# EAGLE design VCFAA_v2 (EAGLE 9.4.2)

## Sheet 1 of 3: Power Supply
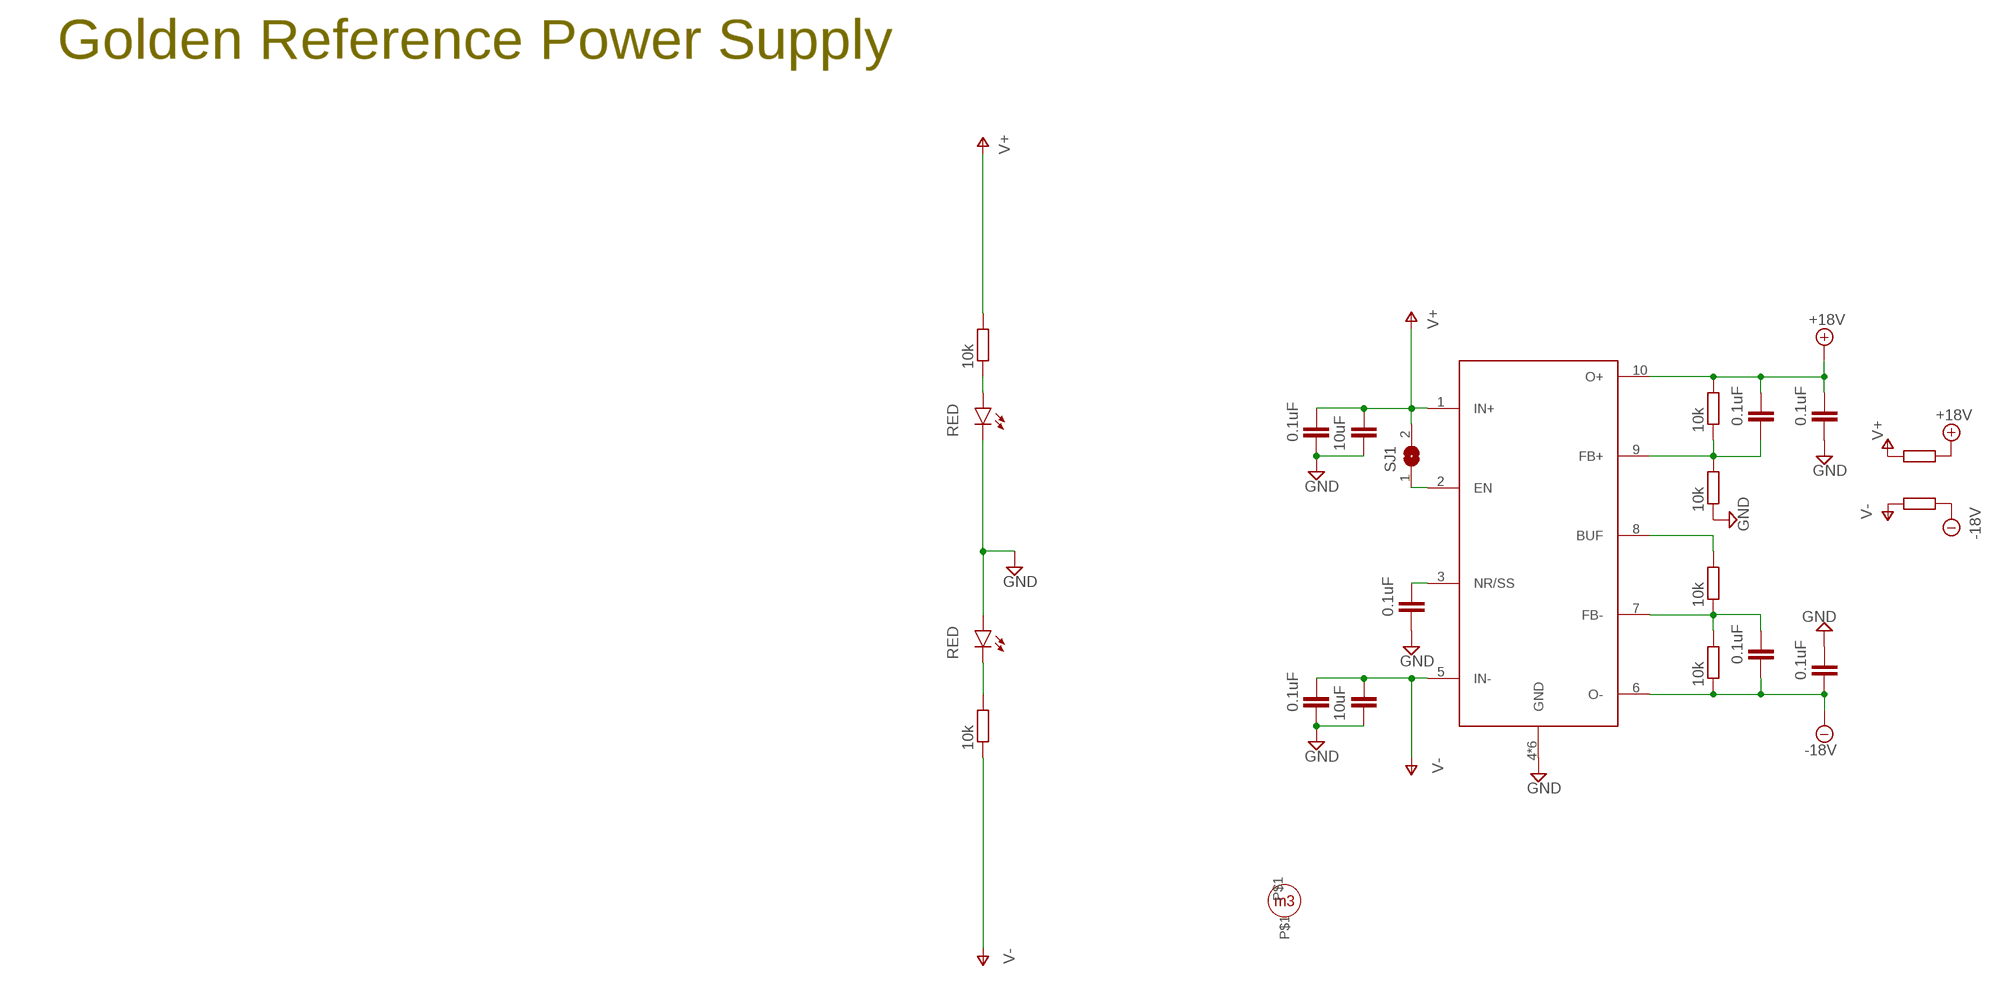
[diagram p0: schematic, sheet 1]

### Parts
C2  0.1uF  C-EUC0805  [C0805]
C65  10uF  C-EUC1206  [C1206]
C66  10uF  C-EUC1206  [C1206]
C67  0.1uF  C-EUC0805  [C0805]
C68  0.1uF  C-EUC0805  [C0805]
C69  0.1uF  C-EUC0805  [C0805]
C70  0.1uF  C-EUC0805  [C0805]
C71  0.1uF  C-EUC0805  [C0805]
C72  0.1uF  C-EUC0805  [C0805]
H8  HOLE  [M3_HOLE]
LED17  RED  LEDVWV1206  [LED_SML1206]
LED18  RED  LEDVWV1206  [LED_SML1206]
R131  10k  R-EU_MELF0204W  [MINI_MELF-0204W]
R132  10k  R-EU_MELF0204W  [MINI_MELF-0204W]
R136  10k  R-EU_MELF0204W  [MINI_MELF-0204W]
R137  10k  R-EU_MELF0204W  [MINI_MELF-0204W]
R138  10k  R-EU_MELF0204W  [MINI_MELF-0204W]
R139  10k  R-EU_MELF0204W  [MINI_MELF-0204W]
R140  10k  R-EU_MELF0204W  [MINI_MELF-0204W]
R141  10k  R-EU_MELF0204W  [MINI_MELF-0204W]
SJ1  SJ  [SJ]
U$5  TPS7A39WSON10-7A39  [SON50P300X300X80-11T165X240N]

### Nets
+18V: C69.1 C71.1 R136.2 R141.1 U$5.10(O+) ; also sheet 2,3
-18V: C70.2 C72.2 R139.1 R140.1 U$5.6(O-) ; also sheet 2,3
GND: C2.2 C65.2 C66.2 C67.2 C68.2 C69.2 C70.1 LED17.C LED18.A R137.1 U$5.4(GND) U$5.11(GND) U$5.12(GND) U$5.13(GND) U$5.14(GND) U$5.15(GND) ; also sheet 2,3
N$24: SJ1.1 U$5.2(EN)
N$138: LED18.C R132.2
N$139: LED17.A R131.1
N$142: C72.1 R138.1 R139.2 U$5.7(FB-)
N$145: R138.2 U$5.8(BUF)
N$146: C71.2 R136.1 R137.2 U$5.9(FB+)
N$148: C2.1 U$5.3(NR/SS)
V+: C66.1 C68.1 R131.2 R141.2 SJ1.2 U$5.1(IN+) ; also sheet 2,3
V-: C65.1 C67.1 R132.1 R140.2 U$5.5(IN-) ; also sheet 2,3
Unconnected: H8.P$1

### Notes on the sheet
- Golden Reference Power Supply

## Sheet 2 of 3: Balance Input Block
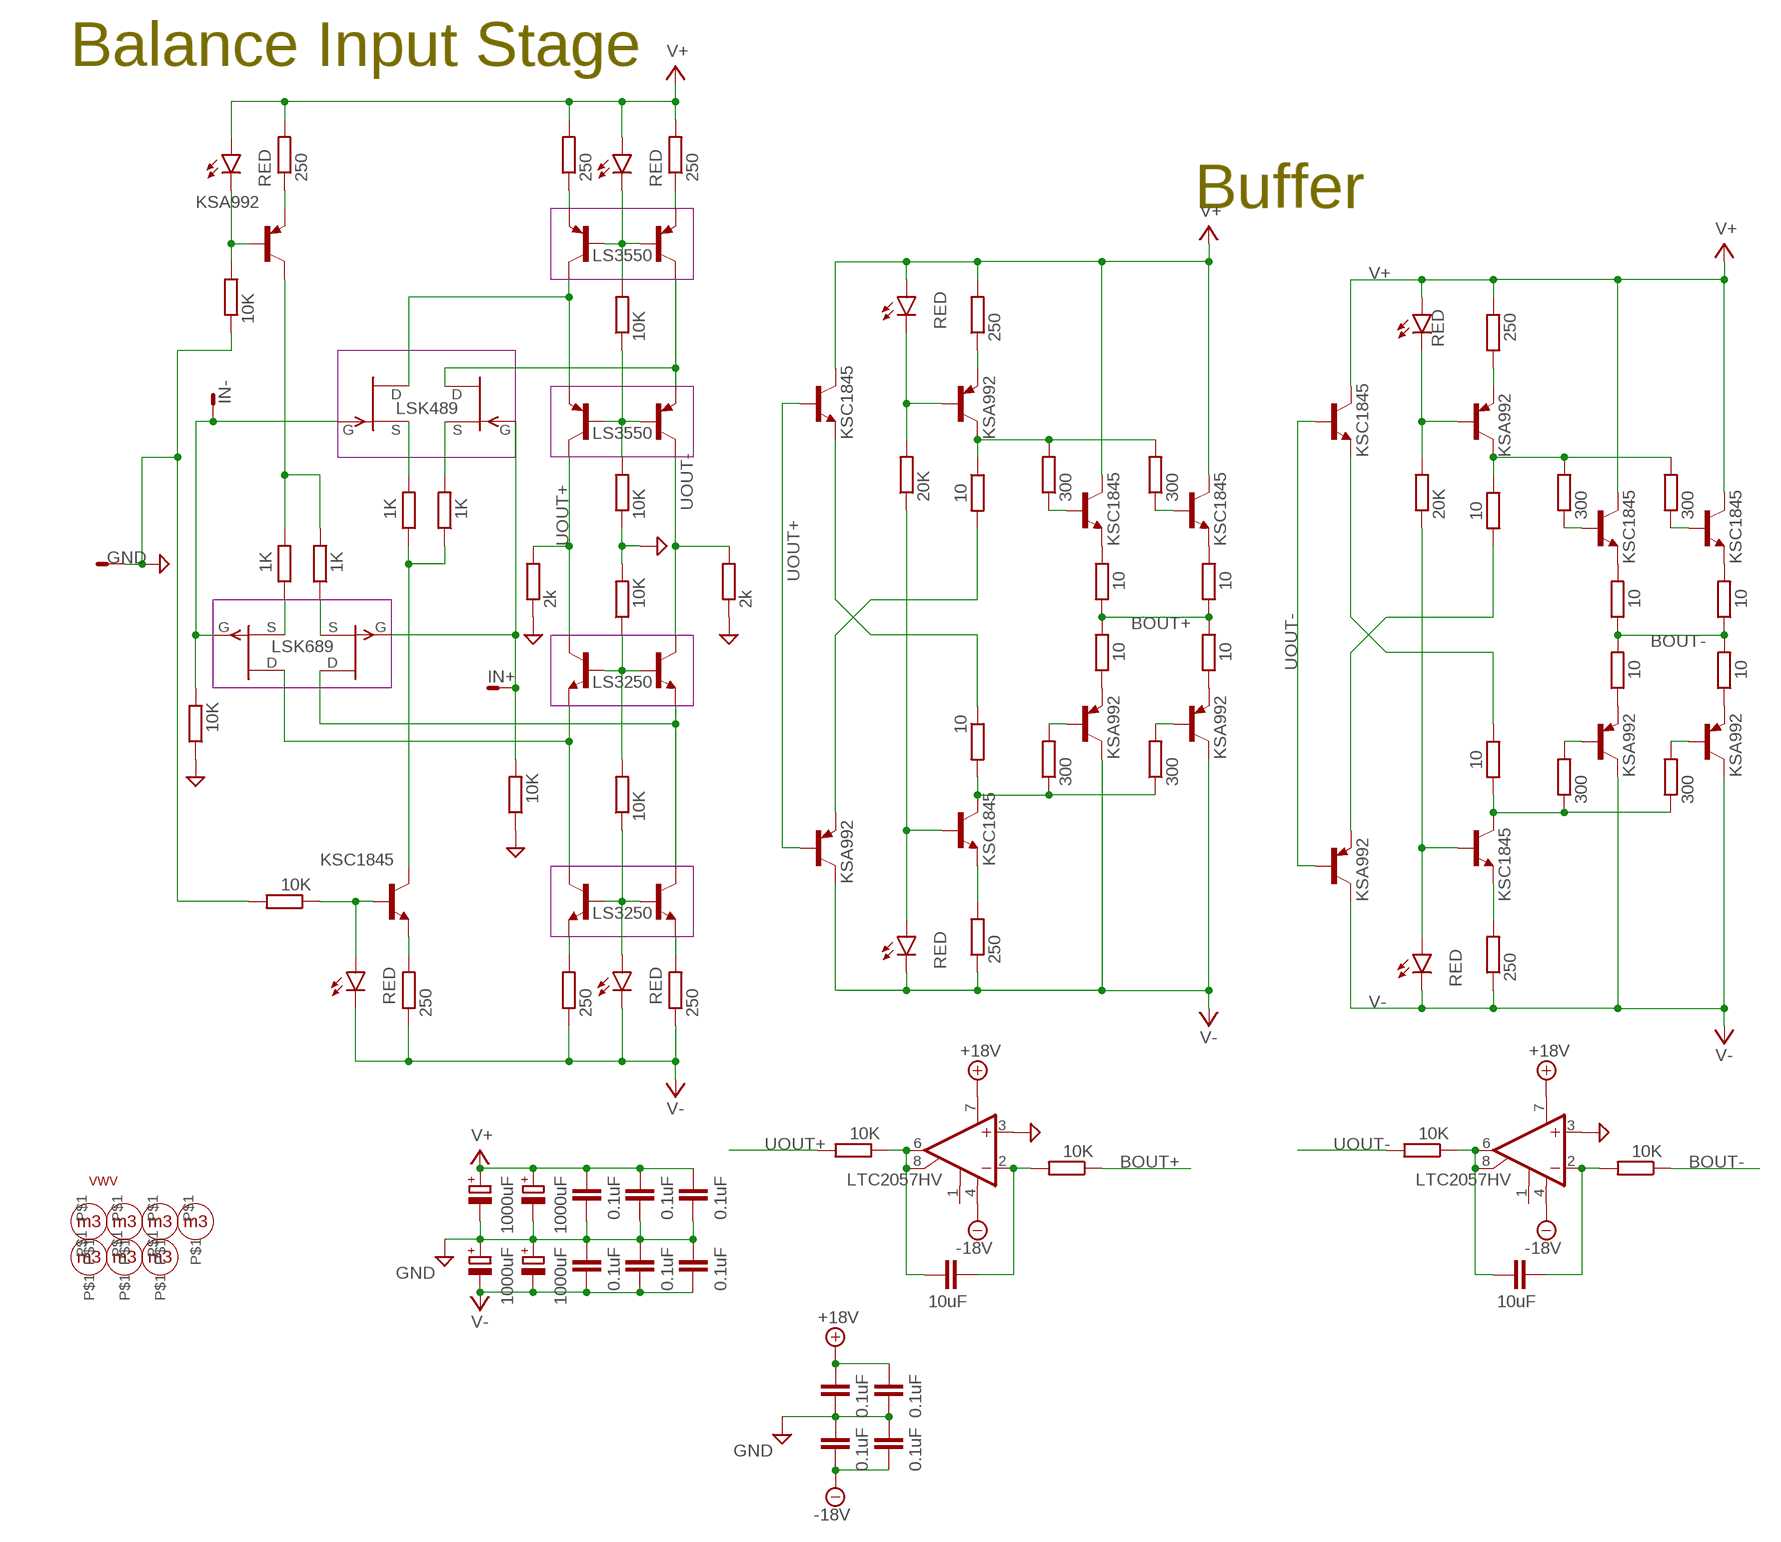
[diagram p1: schematic, sheet 2]

### Parts
C3  0.1uF  C-EUC0805  [C0805]
C4  0.1uF  C-EUC0805  [C0805]
C5  1000uF  CPOL-EUE7.5-18  [E7,5-18]
C6  1000uF  CPOL-EUE7.5-18  [E7,5-18]
C7  1000uF  CPOL-EUE7.5-18  [E7,5-18]
C8  1000uF  CPOL-EUE7.5-18  [E7,5-18]
C9  0.1uF  C-EU050-045X075  [C050-045X075]
C10  0.1uF  C-EU050-045X075  [C050-045X075]
C11  0.1uF  C-EU050-045X075  [C050-045X075]
C12  0.1uF  C-EU050-045X075  [C050-045X075]
C13  10uF  C-EUC1206  [C1206]
C14  0.1uF  C-EUC0805  [C0805]
C15  0.1uF  C-EUC0805  [C0805]
C16  10uF  C-EUC1206  [C1206]
C74  0.1uF  C-EU050-045X075  [C050-045X075]
C75  0.1uF  C-EU050-045X075  [C050-045X075]
H1  HOLE  [M3_HOLE]
H2  HOLE  [M3_HOLE]
H3  HOLE  [M3_HOLE]
H4  HOLE  [M3_HOLE]
H5  HOLE  [M3_HOLE]
H6  HOLE  [M3_HOLE]
H7  HOLE  [M3_HOLE]
IC1  LTC2057HV  LT1007CS8  [SOIC8]
IC2  LTC2057HV  LT1007CS8  [SOIC8]
LED1  RED  LEDVWV1206  [LED_SML1206]
LED2  RED  LEDVWV1206  [LED_SML1206]
LED3  RED  LEDVWV1206  [LED_SML1206]
LED4  RED  LEDVWV1206  [LED_SML1206]
LED5  RED  LEDVWV1206  [LED_SML1206]
LED6  RED  LEDVWV1206  [LED_SML1206]
LED7  RED  LEDVWV1206  [LED_SML1206]
LED8  RED  LEDVWV1206  [LED_SML1206]
Q1  LSK689  [SOT-23-6]
Q2  KSA992  BJT_PNPKSA992  [TRANSISTOR_TO92-ECB_P]
Q3  KSC1845  BJT_NPNKSC1845  [TRANSISTOR_TO92-ECB_N]
Q4  LSK489  LSK489SOP-6  [SOT-23-6]
Q5  LS3550  [SOT-23-6]
Q6  LS3250  [SOT-23-6]
Q7  LS3250  [SOT-23-6]
Q8  LS3550  [SOT-23-6]
Q9  KSC1845  BJT_NPNKSC1845  [TRANSISTOR_TO92-ECB_N]
Q10  KSA992  BJT_PNPKSA992  [TRANSISTOR_TO92-ECB_P]
Q11  KSA992  BJT_PNPKSA992  [TRANSISTOR_TO92-ECB_P]
Q12  KSC1845  BJT_NPNKSC1845  [TRANSISTOR_TO92-ECB_N]
Q13  KSC1845  BJT_NPNKSC1845  [TRANSISTOR_TO92-ECB_N]
Q14  KSA992  BJT_PNPKSA992  [TRANSISTOR_TO92-ECB_P]
Q15  KSC1845  BJT_NPNKSC1845  [TRANSISTOR_TO92-ECB_N]
Q16  KSA992  BJT_PNPKSA992  [TRANSISTOR_TO92-ECB_P]
Q17  KSC1845  BJT_NPNKSC1845  [TRANSISTOR_TO92-ECB_N]
Q18  KSA992  BJT_PNPKSA992  [TRANSISTOR_TO92-ECB_P]
Q19  KSA992  BJT_PNPKSA992  [TRANSISTOR_TO92-ECB_P]
Q20  KSC1845  BJT_NPNKSC1845  [TRANSISTOR_TO92-ECB_N]
Q21  KSC1845  BJT_NPNKSC1845  [TRANSISTOR_TO92-ECB_N]
Q22  KSA992  BJT_PNPKSA992  [TRANSISTOR_TO92-ECB_P]
Q23  KSC1845  BJT_NPNKSC1845  [TRANSISTOR_TO92-ECB_N]
Q24  KSA992  BJT_PNPKSA992  [TRANSISTOR_TO92-ECB_P]
R3  10K  R-EU_MELF0204W  [MINI_MELF-0204W]
R4  10K  R-EU_MELF0204W  [MINI_MELF-0204W]
R5  250  R-EU_MELF0204W  [MINI_MELF-0204W]
R6  1K  R-EU_MELF0204W  [MINI_MELF-0204W]
R7  250  R-EU_MELF0204W  [MINI_MELF-0204W]
R8  1K  R-EU_MELF0204W  [MINI_MELF-0204W]
R9  1K  R-EU_MELF0204W  [MINI_MELF-0204W]
R10  1K  R-EU_MELF0204W  [MINI_MELF-0204W]
R11  2k  R-EU_MELF0204W  [MINI_MELF-0204W]
R12  250  R-EU_MELF0204W  [MINI_MELF-0204W]
R13  250  R-EU_MELF0204W  [MINI_MELF-0204W]
R14  10K  R-EU_MELF0204W  [MINI_MELF-0204W]
R15  10K  R-EU_MELF0204W  [MINI_MELF-0204W]
R16  10K  R-EU_MELF0204W  [MINI_MELF-0204W]
R17  10K  R-EU_MELF0204W  [MINI_MELF-0204W]
R18  250  R-EU_MELF0204W  [MINI_MELF-0204W]
R19  250  R-EU_MELF0204W  [MINI_MELF-0204W]
R20  2k  R-EU_MELF0204W  [MINI_MELF-0204W]
R21  10K  R-EU_MELF0204W  [MINI_MELF-0204W]
R22  20K  R-EU_MELF0204W  [MINI_MELF-0204W]
R23  250  R-EU_MELF0204W  [MINI_MELF-0204W]
R24  10  R-EU_MELF0204W  [MINI_MELF-0204W]
R25  10  R-EU_MELF0204W  [MINI_MELF-0204W]
R26  250  R-EU_MELF0204W  [MINI_MELF-0204W]
R27  300  R-EU_MELF0204W  [MINI_MELF-0204W]
R28  300  R-EU_MELF0204W  [MINI_MELF-0204W]
R29  10K  R-EU_MELF0204W  [MINI_MELF-0204W]
R30  10  R-EU_MELF0204W  [MINI_MELF-0204W]
R31  10  R-EU_MELF0204W  [MINI_MELF-0204W]
R32  300  R-EU_MELF0204W  [MINI_MELF-0204W]
R33  300  R-EU_MELF0204W  [MINI_MELF-0204W]
R34  10  R-EU_MELF0204W  [MINI_MELF-0204W]
R35  10  R-EU_MELF0204W  [MINI_MELF-0204W]
R36  10K  R-EU_MELF0204W  [MINI_MELF-0204W]
R37  20K  R-EU_MELF0204W  [MINI_MELF-0204W]
R38  250  R-EU_MELF0204W  [MINI_MELF-0204W]
R39  10  R-EU_MELF0204W  [MINI_MELF-0204W]
R40  10  R-EU_MELF0204W  [MINI_MELF-0204W]
R41  250  R-EU_MELF0204W  [MINI_MELF-0204W]
R42  300  R-EU_MELF0204W  [MINI_MELF-0204W]
R43  300  R-EU_MELF0204W  [MINI_MELF-0204W]
R44  10K  R-EU_MELF0204W  [MINI_MELF-0204W]
R45  10  R-EU_MELF0204W  [MINI_MELF-0204W]
R46  10  R-EU_MELF0204W  [MINI_MELF-0204W]
R47  300  R-EU_MELF0204W  [MINI_MELF-0204W]
R48  300  R-EU_MELF0204W  [MINI_MELF-0204W]
R49  10  R-EU_MELF0204W  [MINI_MELF-0204W]
R50  10  R-EU_MELF0204W  [MINI_MELF-0204W]
R134  10K  R-EU_MELF0204W  [MINI_MELF-0204W]
R135  10K  R-EU_MELF0204W  [MINI_MELF-0204W]
S1  VWV  [VWV]
X1  KK-156-3  [KK-156-3]

### Nets
+18V: C3.2 C14.2 IC1.7(V+) IC2.7(V+) ; also sheet 1,3
-18V: C4.1 C15.1 IC1.4(V-) IC2.4(V-) ; also sheet 1,3
BOUT+: R29.1 R30.1 R31.2 R34.1 R35.2 ; also sheet 3
BOUT-: R44.1 R45.1 R46.2 R49.1 R50.2 ; also sheet 3
GND: C3.1 C4.2 C5.- C6.+ C7.- C8.+ C9.2 C10.1 C11.2 C12.1 C14.1 C15.2 C74.2 C75.1 IC1.3(+IN) IC2.3(+IN) R3.1 R4.2 R11.1 R15.1 R16.2 R20.1 R134.1 R135.1 X1.2 ; also sheet 1,3
IN+: Q1.4(G) Q4.4(G) R134.2 X1.3
IN-: Q1.1(G) Q4.1(G) R135.2 X1.1
N$2: Q8.2(E) R12.1
N$4: Q10.E R24.2
N$5: Q12.E R26.2
N$6: Q11.E R23.1
N$7: LED5.C Q11.B R22.2
N$8: LED6.A Q12.B R22.1
N$9: Q11.C R24.1 R27.2 R32.2
N$10: Q12.C R25.2 R28.1 R33.1
N$11: Q9.E R25.1
N$13: Q13.B R27.1
N$14: Q13.E R30.2
N$15: Q16.B R33.2
N$16: Q15.B R32.1
N$17: Q14.B R28.2
N$18: Q14.E R31.1
N$19: C13.2 IC1.2(-IN) R29.2
N$20: Q15.E R34.2
N$21: Q16.E R35.1
N$22: C13.1 IC1.6(OUT) IC1.8(CMP2) R21.1
N$23: Q8.5(E) R18.1
N$43: Q20.E R41.2
N$44: Q19.E R38.1
N$45: LED7.C Q19.B R37.2
N$46: LED8.A Q20.B R37.1
N$47: Q19.C R39.1 R42.2 R47.2
N$48: Q20.C R40.2 R43.1 R48.1
N$49: Q18.E R39.2
N$50: Q17.E R40.1
N$52: Q21.B R42.1
N$53: Q22.B R43.2
N$54: Q23.B R47.1
N$55: Q24.B R48.2
N$56: Q21.E R45.2
N$57: Q22.E R46.1
N$58: Q23.E R49.2
N$59: Q24.E R50.1
N$60: C16.2 IC2.2(-IN) R44.2
N$61: C16.1 IC2.6(OUT) IC2.8(CMP2) R36.1
N$93: Q7.5(E) R13.2
N$94: Q7.2(E) R19.2
N$95: Q1.5(D) Q6.2(E) Q7.4(C)
N$96: Q1.2(D) Q6.5(E) Q7.6(C)
N$97: LED4.A Q7.1(B) Q7.3(B) R17.1
N$98: Q6.1(B) Q6.3(B) R16.1 R17.2
N$99: LED2.A Q3.B R4.1
N$101: Q5.1(B) Q5.3(B) R14.1 R15.2
N$102: Q4.2(D) Q5.5(E) Q8.4(C)
N$103: LED3.C Q8.1(B) Q8.3(B) R14.2
N$104: Q4.5(D) Q5.2(E) Q8.6(C)
N$108: LED1.C Q2.B R3.2
N$109: Q2.E R5.1
N$110: Q2.C R6.2 R8.2
N$111: Q1.6(S) R8.1
N$112: Q1.3(S) R6.1
N$115: Q4.3(S) R9.2
N$116: Q4.6(S) R10.2
N$117: Q3.C R9.1 R10.1
N$118: Q3.E R7.2
UOUT+: Q5.6(C) Q6.6(C) Q9.B Q10.B R11.2 R21.2
UOUT-: Q5.4(C) Q6.4(C) Q17.B Q18.B R20.2 R36.2
V+: C5.+ C7.+ C9.1 C11.1 C74.1 LED1.A LED3.A LED5.A LED7.A Q9.C Q13.C Q15.C Q17.C Q21.C Q23.C R5.2 R12.2 R18.2 R23.2 R38.2 ; also sheet 1,3
V-: C6.- C8.- C10.2 C12.2 C75.2 LED2.C LED4.C LED6.C LED8.C Q10.C Q14.C Q16.C Q18.C Q22.C Q24.C R7.1 R13.1 R19.1 R26.1 R41.1 ; also sheet 1,3
Unconnected: H1.P$1 H2.P$1 H3.P$1 H4.P$1 H5.P$1 H6.P$1 H7.P$1 IC1.1(CMP1) IC2.1(CMP1)

### Notes on the sheet
- Balance Input Stage
- Buffer

## Sheet 3 of 3: CFA Block
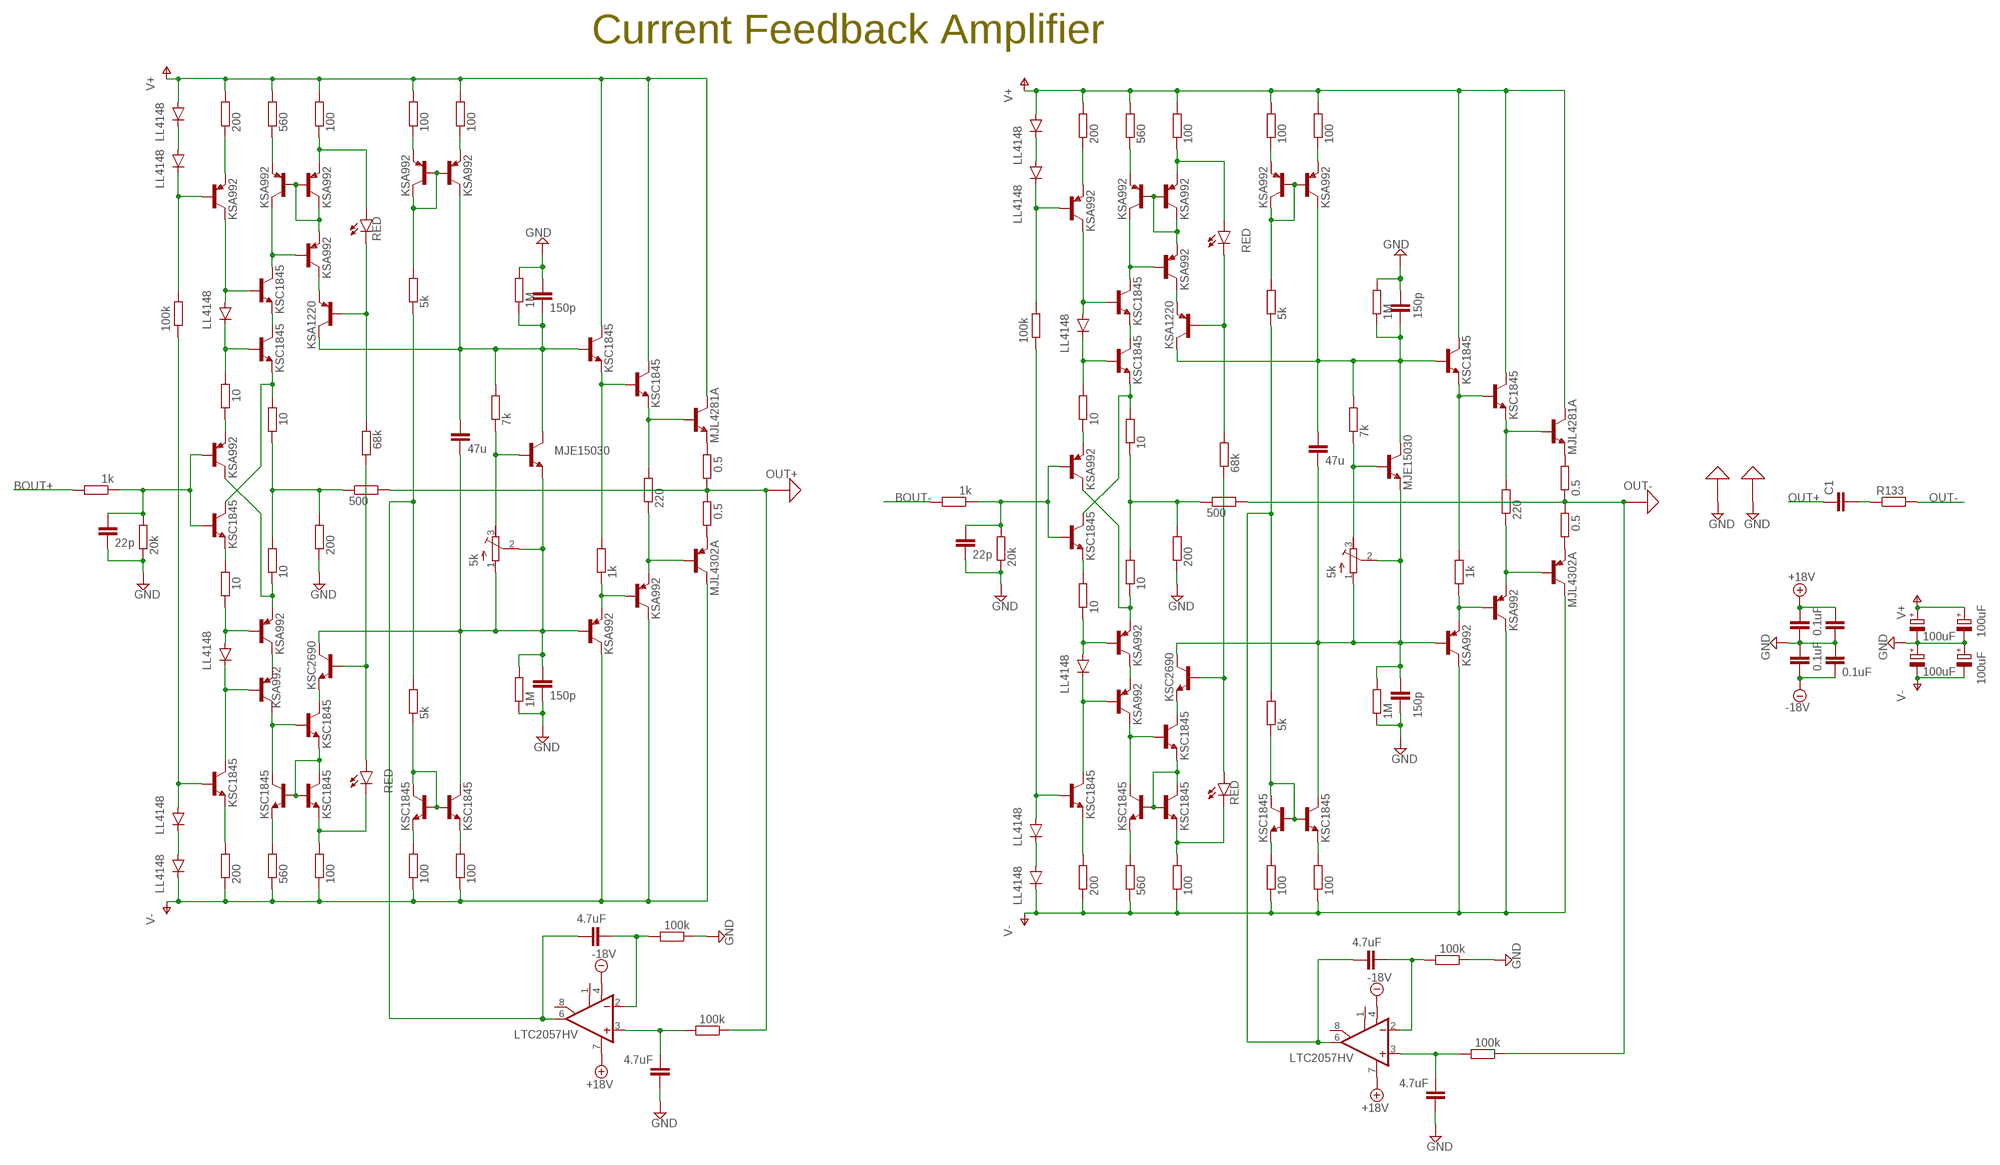
[diagram p2: schematic, sheet 3]

### Parts
C1  C-EUECWU-V  [ECHU-Y]
C17  22p  C-EUC0805  [C0805]
C18  47u  C-EUC1210  [C1210]
C19  150p  C-EUC0805  [C0805]
C20  150p  C-EUC0805  [C0805]
C21  4.7uF  C-EUC1210  [C1210]
C22  4.7uF  C-EUC1210  [C1210]
C23  0.1uF  C-EUC0603K  [C0603K]
C24  0.1uF  C-EUC0603K  [C0603K]
C25  100uF  CPOL-EUE5-8.5  [E5-8,5]
C26  100uF  CPOL-EUE5-8.5  [E5-8,5]
C27  22p  C-EUC0805  [C0805]
C28  47u  C-EUC1210  [C1210]
C29  150p  C-EUC0805  [C0805]
C30  150p  C-EUC0805  [C0805]
C31  4.7uF  C-EUC1210  [C1210]
C32  4.7uF  C-EUC1210  [C1210]
C33  0.1uF  C-EUC0603K  [C0603K]
C34  0.1uF  C-EUC0603K  [C0603K]
C35  100uF  CPOL-EUE5-8.5  [E5-8,5]
C36  100uF  CPOL-EUE5-8.5  [E5-8,5]
D1  LL4148  DIODE-SOD80C  [SOD80C]
D2  LL4148  DIODE-SOD80C  [SOD80C]
D3  LL4148  DIODE-SOD80C  [SOD80C]
D4  LL4148  DIODE-SOD80C  [SOD80C]
D5  LL4148  DIODE-SOD80C  [SOD80C]
D6  LL4148  DIODE-SOD80C  [SOD80C]
D7  LL4148  DIODE-SOD80C  [SOD80C]
D8  LL4148  DIODE-SOD80C  [SOD80C]
D9  LL4148  DIODE-SOD80C  [SOD80C]
D10  LL4148  DIODE-SOD80C  [SOD80C]
D11  LL4148  DIODE-SOD80C  [SOD80C]
D12  LL4148  DIODE-SOD80C  [SOD80C]
IC3  LTC2057HV  LT1037IS8  [SOIC8]
IC4  LTC2057HV  LT1037IS8  [SOIC8]
LED9  RED  LEDVWV1206  [LED_SML1206]
LED10  RED  LEDVWV1206  [LED_SML1206]
LED11  RED  LEDVWV1206  [LED_SML1206]
LED12  RED  LEDVWV1206  [LED_SML1206]
PAD1  PAD  [PAD-16]
PAD2  PAD  [PAD-16]
PAD3  PAD  [PAD-16]
PAD4  PAD  [PAD-16]
Q25  KSA992  BJT_PNPKSA992  [TRANSISTOR_TO92-ECB_P]
Q26  KSA992  BJT_PNPKSA992  [TRANSISTOR_TO92-ECB_P]
Q27  KSC1845  BJT_NPNKSC1845  [TRANSISTOR_TO92-ECB_N]
Q28  KSC1845  BJT_NPNKSC1845  [TRANSISTOR_TO92-ECB_N]
Q29  KSC1845  BJT_NPNKSC1845  [TRANSISTOR_TO92-ECB_N]
Q30  KSC1845  BJT_NPNKSC1845  [TRANSISTOR_TO92-ECB_N]
Q31  KSA992  BJT_PNPKSA992  [TRANSISTOR_TO92-ECB_P]
Q32  KSA992  BJT_PNPKSA992  [TRANSISTOR_TO92-ECB_P]
Q33  KSA992  BJT_PNPKSA992  [TRANSISTOR_TO92-ECB_P]
Q34  KSC1845  BJT_NPNKSC1845  [TRANSISTOR_TO92-ECB_N]
Q35  KSA992  BJT_PNPKSA992  [TRANSISTOR_TO92-ECB_P]
Q36  KSA992  BJT_PNPKSA992  [TRANSISTOR_TO92-ECB_P]
Q37  KSC1845  BJT_NPNKSC1845  [TRANSISTOR_TO92-ECB_N]
Q38  KSC1845  BJT_NPNKSC1845  [TRANSISTOR_TO92-ECB_N]
Q39  KSA1220  BJT_PNPKSA1220  [TRANSISTOR_TO126_P]
Q40  KSC2690  BJT_NPNKSC2690  [TRANSISTOR_TO126_N]
Q41  KSA992  BJT_PNPKSA992  [TRANSISTOR_TO92-ECB_P]
Q42  KSC1845  BJT_NPNKSC1845  [TRANSISTOR_TO92-ECB_N]
Q43  KSA992  BJT_PNPKSA992  [TRANSISTOR_TO92-ECB_P]
Q44  KSC1845  BJT_NPNKSC1845  [TRANSISTOR_TO92-ECB_N]
Q45  MJE15030  BJT_NPNMJE15030  [TRANSISTOR_TO220_BCE_N]
Q46  KSC1845  BJT_NPNKSC1845  [TRANSISTOR_TO92-ECB_N]
Q47  KSA992  BJT_PNPKSA992  [TRANSISTOR_TO92-ECB_P]
Q48  KSC1845  BJT_NPNKSC1845  [TRANSISTOR_TO92-ECB_N]
Q49  KSA992  BJT_PNPKSA992  [TRANSISTOR_TO92-ECB_P]
Q50  MJL4281A  BJT_NPNMJL4281  [TRANSISTOR_TO247_BCE_N]
Q51  MJL4302A  BJT_PNPMJL4302  [TRANSISTOR_TO247_BCE_P]
Q52  KSA992  BJT_PNPKSA992  [TRANSISTOR_TO92-ECB_P]
Q53  KSA992  BJT_PNPKSA992  [TRANSISTOR_TO92-ECB_P]
Q54  KSC1845  BJT_NPNKSC1845  [TRANSISTOR_TO92-ECB_N]
Q55  KSC1845  BJT_NPNKSC1845  [TRANSISTOR_TO92-ECB_N]
Q56  KSC1845  BJT_NPNKSC1845  [TRANSISTOR_TO92-ECB_N]
Q57  KSC1845  BJT_NPNKSC1845  [TRANSISTOR_TO92-ECB_N]
Q58  KSA992  BJT_PNPKSA992  [TRANSISTOR_TO92-ECB_P]
Q59  KSA992  BJT_PNPKSA992  [TRANSISTOR_TO92-ECB_P]
Q60  KSA992  BJT_PNPKSA992  [TRANSISTOR_TO92-ECB_P]
Q61  KSC1845  BJT_NPNKSC1845  [TRANSISTOR_TO92-ECB_N]
Q62  KSA992  BJT_PNPKSA992  [TRANSISTOR_TO92-ECB_P]
Q63  KSA992  BJT_PNPKSA992  [TRANSISTOR_TO92-ECB_P]
Q64  KSC1845  BJT_NPNKSC1845  [TRANSISTOR_TO92-ECB_N]
Q65  KSC1845  BJT_NPNKSC1845  [TRANSISTOR_TO92-ECB_N]
Q66  KSA1220  BJT_PNPKSA1220  [TRANSISTOR_TO126_P]
Q67  KSC2690  BJT_NPNKSC2690  [TRANSISTOR_TO126_N]
Q68  KSA992  BJT_PNPKSA992  [TRANSISTOR_TO92-ECB_P]
Q69  KSC1845  BJT_NPNKSC1845  [TRANSISTOR_TO92-ECB_N]
Q70  KSA992  BJT_PNPKSA992  [TRANSISTOR_TO92-ECB_P]
Q71  KSC1845  BJT_NPNKSC1845  [TRANSISTOR_TO92-ECB_N]
Q72  MJE15030  BJT_NPNMJE15030  [TRANSISTOR_TO220_BCE_N]
Q73  KSC1845  BJT_NPNKSC1845  [TRANSISTOR_TO92-ECB_N]
Q74  KSA992  BJT_PNPKSA992  [TRANSISTOR_TO92-ECB_P]
Q75  KSC1845  BJT_NPNKSC1845  [TRANSISTOR_TO92-ECB_N]
Q76  KSA992  BJT_PNPKSA992  [TRANSISTOR_TO92-ECB_P]
Q77  MJL4281A  BJT_NPNMJL4281  [TRANSISTOR_TO247_BCE_N]
Q78  MJL4302A  BJT_PNPMJL4302  [TRANSISTOR_TO247_BCE_P]
R51  1k  R-EU_MELF0204W  [MINI_MELF-0204W]
R52  20k  R-EU_MELF0204W  [MINI_MELF-0204W]
R53  100k  R-EU_MELF0204W  [MINI_MELF-0204W]
R54  200  R-EU_MELF0204W  [MINI_MELF-0204W]
R55  10  R-EU_MELF0204W  [MINI_MELF-0204W]
R56  10  R-EU_MELF0204W  [MINI_MELF-0204W]
R57  200  R-EU_MELF0204W  [MINI_MELF-0204W]
R58  560  R-EU_MELF0204W  [MINI_MELF-0204W]
R59  10  R-EU_MELF0204W  [MINI_MELF-0204W]
R60  10  R-EU_MELF0204W  [MINI_MELF-0204W]
R61  560  R-EU_MELF0204W  [MINI_MELF-0204W]
R62  100  R-EU_MELF0204W  [MINI_MELF-0204W]
R63  200  R-EU_MELF0204W  [MINI_MELF-0204W]
R64  100  R-EU_MELF0204W  [MINI_MELF-0204W]
R65  68k  R-EU_MELF0204W  [MINI_MELF-0204W]
R66  500  R-EU_MELF0204W  [MINI_MELF-0204W]
R67  100  R-EU_MELF0204W  [MINI_MELF-0204W]
R68  5k  R-EU_MELF0204W  [MINI_MELF-0204W]
R69  5k  R-EU_MELF0204W  [MINI_MELF-0204W]
R70  100  R-EU_MELF0204W  [MINI_MELF-0204W]
R71  100  R-EU_MELF0204W  [MINI_MELF-0204W]
R72  100  R-EU_MELF0204W  [MINI_MELF-0204W]
R73  7k  R-EU_MELF0204W  [MINI_MELF-0204W]
R74  5k  R-TRIMM3296W  [RTRIM3296W]
R75  1M  R-EU_MELF0204W  [MINI_MELF-0204W]
R76  1M  R-EU_MELF0204W  [MINI_MELF-0204W]
R77  1k  R-EU_MELF0204W  [MINI_MELF-0204W]
R78  220  R-EU_MELF0204W  [MINI_MELF-0204W]
R79  100k  R-EU_MELF0204W  [MINI_MELF-0204W]
R80  0.5  R-EU_R2512  [R2512]
R81  0.5  R-EU_R2512  [R2512]
R82  100k  R-EU_MELF0204W  [MINI_MELF-0204W]
R83  1k  R-EU_MELF0204W  [MINI_MELF-0204W]
R84  20k  R-EU_MELF0204W  [MINI_MELF-0204W]
R85  100k  R-EU_MELF0204W  [MINI_MELF-0204W]
R86  200  R-EU_MELF0204W  [MINI_MELF-0204W]
R87  10  R-EU_MELF0204W  [MINI_MELF-0204W]
R88  10  R-EU_MELF0204W  [MINI_MELF-0204W]
R89  200  R-EU_MELF0204W  [MINI_MELF-0204W]
R90  560  R-EU_MELF0204W  [MINI_MELF-0204W]
R91  10  R-EU_MELF0204W  [MINI_MELF-0204W]
R92  10  R-EU_MELF0204W  [MINI_MELF-0204W]
R93  560  R-EU_MELF0204W  [MINI_MELF-0204W]
R94  100  R-EU_MELF0204W  [MINI_MELF-0204W]
R95  200  R-EU_MELF0204W  [MINI_MELF-0204W]
R96  100  R-EU_MELF0204W  [MINI_MELF-0204W]
R97  68k  R-EU_MELF0204W  [MINI_MELF-0204W]
R98  500  R-EU_MELF0204W  [MINI_MELF-0204W]
R99  100  R-EU_MELF0204W  [MINI_MELF-0204W]
R100  5k  R-EU_MELF0204W  [MINI_MELF-0204W]
R101  5k  R-EU_MELF0204W  [MINI_MELF-0204W]
R102  100  R-EU_MELF0204W  [MINI_MELF-0204W]
R103  100  R-EU_MELF0204W  [MINI_MELF-0204W]
R104  100  R-EU_MELF0204W  [MINI_MELF-0204W]
R105  7k  R-EU_MELF0204W  [MINI_MELF-0204W]
R106  5k  R-TRIMM3296W  [RTRIM3296W]
R107  1M  R-EU_MELF0204W  [MINI_MELF-0204W]
R108  1M  R-EU_MELF0204W  [MINI_MELF-0204W]
R109  1k  R-EU_MELF0204W  [MINI_MELF-0204W]
R110  220  R-EU_MELF0204W  [MINI_MELF-0204W]
R111  100k  R-EU_MELF0204W  [MINI_MELF-0204W]
R112  0.5  R-EU_R2512  [R2512]
R113  0.5  R-EU_R2512  [R2512]
R114  100k  R-EU_MELF0204W  [MINI_MELF-0204W]
R133  R-EU_R2512  [R2512]

### Nets
+18V: C23.1 C33.1 IC3.7(V+) IC4.7(V+) ; also sheet 1,2
-18V: C24.2 C34.2 IC3.4(V-) IC4.4(V-) ; also sheet 1,2
BOUT+: R51.2 ; also sheet 2
BOUT-: R83.2 ; also sheet 2
GND: C17.2 C19.1 C20.2 C22.1 C23.2 C24.1 C25.- C26.+ C27.2 C29.1 C30.2 C32.1 C33.2 C34.1 C35.- C36.+ PAD3.P$1 PAD4.P$1 R52.1 R63.1 R75.2 R76.1 R79.1 R84.1 R95.1 R107.2 R108.1 R111.1 ; also sheet 1,2
N$3: Q25.E R54.1
N$12: D5.A Q25.C Q29.B
N$25: D1.C D2.A
N$26: D2.C Q25.B R53.2
N$27: D5.C Q30.B R55.2
N$28: Q29.E Q30.C
N$29: Q27.C Q30.E R59.2
N$30: R59.1 R60.2 R63.2 R66.1
N$31: Q26.C Q31.E R60.1
N$32: D6.A Q31.B R56.1
N$33: D6.C Q28.C Q32.B
N$34: Q28.E R57.2
N$35: D3.C D4.A
N$36: Q31.C Q32.E
N$37: Q26.E R55.1
N$38: Q27.E R56.2
N$39: C17.1 Q26.B Q27.B R51.1 R52.2
N$40: Q29.C Q33.C Q36.B
N$41: Q33.B Q35.B Q35.C Q36.E
N$42: Q33.E R58.1
N$51: LED9.A Q35.E R62.1
N$62: Q36.C Q39.E
N$63: LED9.C Q39.B R65.2
N$64: Q34.B Q37.E Q38.B Q38.C
N$65: LED10.C Q38.E R64.2
N$66: Q34.E R61.2
N$67: Q32.C Q34.C Q37.B
N$68: Q37.C Q40.E
N$69: LED10.A Q40.B R65.1
N$70: C18.1 C19.2 Q39.C Q43.C Q45.C Q46.B R73.2 R75.1
N$71: Q41.B Q41.C Q43.B R68.2
N$72: Q42.B Q42.C Q44.B R69.1
N$73: Q41.E R67.1
N$74: Q43.E R71.1
N$76: Q42.E R70.2
N$77: Q44.E R72.2
N$78: Q46.E Q48.B R77.2
N$79: Q47.E Q49.B R77.1
N$80: C18.2 C20.1 Q40.C Q44.C Q45.E Q47.B R74.1(A) R74.2(S) R76.2
N$81: Q48.E Q50.B R78.2
N$82: Q49.E Q51.B R78.1
N$83: Q50.E R80.2
N$84: Q51.E R81.1
N$85: C21.2 IC3.2(-IN) R79.2
N$86: C22.2 IC3.3(+IN) R82.2
N$87: D3.A Q28.B R53.1
N$88: Q45.B R73.1 R74.3(E)
N$89: C21.1 IC3.6(OUT) R68.1 R69.2
N$140: C1.2 R133.1
N$159: Q52.E R86.1
N$160: D11.A Q52.C Q56.B
N$161: D7.C D8.A
N$162: D8.C Q52.B R85.2
N$163: D11.C Q57.B R87.2
N$164: Q56.E Q57.C
N$165: Q54.C Q57.E R91.2
N$166: R91.1 R92.2 R95.2 R98.1
N$167: Q53.C Q58.E R92.1
N$168: D12.A Q58.B R88.1
N$169: D12.C Q55.C Q59.B
N$170: Q55.E R89.2
N$171: D9.C D10.A
N$172: Q58.C Q59.E
N$173: Q53.E R87.1
N$174: Q54.E R88.2
N$175: C27.1 Q53.B Q54.B R83.1 R84.2
N$176: Q56.C Q60.C Q63.B
N$177: Q60.B Q62.B Q62.C Q63.E
N$178: Q60.E R90.1
N$179: LED11.A Q62.E R94.1
N$180: Q63.C Q66.E
N$181: LED11.C Q66.B R97.2
N$182: Q61.B Q64.E Q65.B Q65.C
N$231: LED12.C Q65.E R96.2
N$232: Q61.E R93.2
N$233: Q59.C Q61.C Q64.B
N$234: Q64.C Q67.E
N$235: LED12.A Q67.B R97.1
N$236: C28.1 C29.2 Q66.C Q70.C Q72.C Q73.B R105.2 R107.1
N$237: Q68.B Q68.C Q70.B R100.2
N$238: Q69.B Q69.C Q71.B R101.1
N$239: Q68.E R99.1
N$240: Q70.E R103.1
N$242: Q69.E R102.2
N$243: Q71.E R104.2
N$244: Q73.E Q75.B R109.2
N$245: Q74.E Q76.B R109.1
N$246: C28.2 C30.1 Q67.C Q71.C Q72.E Q74.B R106.1(A) R106.2(S) R108.2
N$247: Q75.E Q77.B R110.2
N$248: Q76.E Q78.B R110.1
N$249: Q77.E R112.2
N$250: Q78.E R113.1
N$251: C31.2 IC4.2(-IN) R111.2
N$252: C32.2 IC4.3(+IN) R114.2
N$253: D9.A Q55.B R85.1
N$254: Q72.B R105.1 R106.3(E)
N$255: C31.1 IC4.6(OUT) R100.1 R101.2
OUT+: C1.1 PAD1.P$1 R66.2 R80.1 R81.2 R82.1
OUT-: PAD2.P$1 R98.2 R112.1 R113.2 R114.1 R133.2
V+: C25.+ C35.+ D1.A D7.A Q46.C Q48.C Q50.C Q73.C Q75.C Q77.C R54.2 R58.2 R62.2 R67.2 R71.2 R86.2 R90.2 R94.2 R99.2 R103.2 ; also sheet 1,2
V-: C26.- C36.- D4.C D10.C Q47.C Q49.C Q51.C Q74.C Q76.C Q78.C R57.1 R61.1 R64.1 R70.1 R72.1 R89.1 R93.1 R96.1 R102.1 R104.1 ; also sheet 1,2
Unconnected: IC3.1(CMP1) IC3.8(CMP2) IC4.1(CMP1) IC4.8(CMP2)

### Notes on the sheet
- Current Feedback Amplifier

## Library data of the parts
C1-C4 C9-C16 C23 C24 C33 C34 C65-C72 C74 C75 = Vwvwbg:C-EU: CAPACITOR, European symbol
C5-C8 C25 C26 C35 C36 = Vwvwbg:CPOL-EU: POLARIZED CAPACITOR, European symbol
C17-C22 C27-C32 = Vwvwbg:C-EU: CAPACITOR, European symbol; SPICEPREFIX: C
D1-D12 = Vwvwbg:DIODE-: DIODE; SPICEPREFIX: D
H1-H8 = Vwvwbg:HOLE
IC1-IC4 = Vwvwbg:LT10*: Low Noise, High Speed, Precision Operational Amplifiers Source: http://www.linear.com/pc/downloadDocument.do?navId=H0,C1,C1154,C1009,C1026,P1212,D2204
LED1 LED3-LED8 LED17 LED18 = Vwvwbg:LED: LED OSRAM: - CHIPLED LG R971, LG N971, LY N971, LG Q971, LY Q971, LO R971, LY R971 LH N974, LH R974 LS Q976, LO Q976, LY Q976 LO Q996 - Hyper CHIPLED LW Q18S LB Q993, LB Q99A, LB R99A - SideLED LS A670, LO A670, LY A670, LG A670, LP A670 LB A673, LV A673, LT A673, LW A673 LH A674 LY A675 LS A676, LA A676, LO A676, LY A676, LW A676 LS A679, LY A679, LG A679 - Hyper Micro SIDELED® LS Y876, LA Y876, LO Y876, LY Y876 LT Y87S - SmartLED LW L88C, LW L88S LB L89C, LB L89S, LG L890 LS L89K, LO L89K, LY L89K LS L896, LA L896, LO L896, LY L896 - TOPLED LS T670, LO T670, LY T670, LG T670, LP T670 LSG T670, LSP T670, LSY T670, LOP T670, LYG T670 LG T671, LOG T671, LSG T671 LB T673, LV T673, LT T673, LW T673 LH T674 LS T676, LA T676, LO T676, LY T676, LB T676, LH T676, LSB T676, LW T676 LB T67C, LV T67C, LT T67C, LS T67K, LO T67K, LY T67K, LW E67C LS E67B, LA E67B, LO E67B, LY E67B, LB E67C, LV E67C, LT E67C LW T67C LS T679, LY T679, LG T679 LS T770, LO T770, LY T770, LG T770, LP T770 LB T773, LV T773, LT T773, LW T773 LH T774 LS E675, LA E675, LY E675, LS T675 LS T776, LA T776, LO T776, LY T776, LB T776 LHGB T686 LT T68C, LB T68C - Hyper Mini TOPLED® LB M676 - Mini TOPLED Santana® LG M470 LS M47K, LO M47K, LY M47K Source: http://www.osram.convergy.de LUXEON: - LUMILED® LXK2-PW12-R00, LXK2-PW12-S00, LXK2-PW14-U00, LXK2-PW14-V00 LXK2-PM12-R00, LXK2-PM12-S00, LXK2-PM14-U00 LXK2-PE12-Q00, LXK2-PE12-R00, LXK2-PE12-S00, LXK2-PE14-T00, LXK2-PE14-U00 LXK2-PB12-K00, LXK2-PB12-L00, LXK2-PB12-M00, LXK2-PB14-N00, LXK2-PB14-P00, LXK2-PB14-Q00 LXK2-PR12-L00, LXK2-PR12-M00, LXK2-PR14-Q00, LXK2-PR14-R00 LXK2-PD12-Q00, LXK2-PD12-R00, LXK2-PD12-S00 LXK2-PH12-R00, LXK2-PH12-S00 LXK2-PL12-P00, LXK2-PL12-Q00, LXK2-PL12-R00 Source: www.luxeon.com KINGBRIGHT: KA-3528ASYC Source: www.kingbright.com
LED2 LED9-LED12 = Vwvwbg:LED: LED OSRAM: - CHIPLED LG R971, LG N971, LY N971, LG Q971, LY Q971, LO R971, LY R971 LH N974, LH R974 LS Q976, LO Q976, LY Q976 LO Q996 - Hyper CHIPLED LW Q18S LB Q993, LB Q99A, LB R99A - SideLED LS A670, LO A670, LY A670, LG A670, LP A670 LB A673, LV A673, LT A673, LW A673 LH A674 LY A675 LS A676, LA A676, LO A676, LY A676, LW A676 LS A679, LY A679, LG A679 - Hyper Micro SIDELED® LS Y876, LA Y876, LO Y876, LY Y876 LT Y87S - SmartLED LW L88C, LW L88S LB L89C, LB L89S, LG L890 LS L89K, LO L89K, LY L89K LS L896, LA L896, LO L896, LY L896 - TOPLED LS T670, LO T670, LY T670, LG T670, LP T670 LSG T670, LSP T670, LSY T670, LOP T670, LYG T670 LG T671, LOG T671, LSG T671 LB T673, LV T673, LT T673, LW T673 LH T674 LS T676, LA T676, LO T676, LY T676, LB T676, LH T676, LSB T676, LW T676 LB T67C, LV T67C, LT T67C, LS T67K, LO T67K, LY T67K, LW E67C LS E67B, LA E67B, LO E67B, LY E67B, LB E67C, LV E67C, LT E67C LW T67C LS T679, LY T679, LG T679 LS T770, LO T770, LY T770, LG T770, LP T770 LB T773, LV T773, LT T773, LW T773 LH T774 LS E675, LA E675, LY E675, LS T675 LS T776, LA T776, LO T776, LY T776, LB T776 LHGB T686 LT T68C, LB T68C - Hyper Mini TOPLED® LB M676 - Mini TOPLED Santana® LG M470 LS M47K, LO M47K, LY M47K Source: http://www.osram.convergy.de LUXEON: - LUMILED® LXK2-PW12-R00, LXK2-PW12-S00, LXK2-PW14-U00, LXK2-PW14-V00 LXK2-PM12-R00, LXK2-PM12-S00, LXK2-PM14-U00 LXK2-PE12-Q00, LXK2-PE12-R00, LXK2-PE12-S00, LXK2-PE14-T00, LXK2-PE14-U00 LXK2-PB12-K00, LXK2-PB12-L00, LXK2-PB12-M00, LXK2-PB14-N00, LXK2-PB14-P00, LXK2-PB14-Q00 LXK2-PR12-L00, LXK2-PR12-M00, LXK2-PR14-Q00, LXK2-PR14-R00 LXK2-PD12-Q00, LXK2-PD12-R00, LXK2-PD12-S00 LXK2-PH12-R00, LXK2-PH12-S00 LXK2-PL12-P00, LXK2-PL12-Q00, LXK2-PL12-R00 Source: www.luxeon.com KINGBRIGHT: KA-3528ASYC Source: www.kingbright.com; SPICEPREFIX: D
PAD1-PAD4 = Vwvwbg:PAD
Q1 = Vwvwbg:LSK689
Q2 Q10 Q11 Q14 Q16 Q18 Q19 Q22 Q24 = Vwvwbg:BJT_PNP
Q3 Q9 Q12 Q13 Q15 Q17 Q20 Q21 Q23 = Vwvwbg:BJT_NPN
Q4 = Vwvwbg:LSK489
Q5 Q8 = Vwvwbg:LS3550
Q6 Q7 = Vwvwbg:LS3250
Q25 Q26 Q31-Q33 Q35 Q36 Q39 Q41 Q43 Q47 Q49 Q51-Q53 Q58-Q60 Q62 Q63 Q66 Q68 Q70 Q74 Q76 Q78 = Vwvwbg:BJT_PNP; SPICEPREFIX: Q
Q27-Q30 Q34 Q37 Q38 Q40 Q42 Q44-Q46 Q48 Q50 Q54-Q57 Q61 Q64 Q65 Q67 Q69 Q71-Q73 Q75 Q77 = Vwvwbg:BJT_NPN; SPICEPREFIX: Q
R3-R6 R8-R50 R131-R141 = Vwvwbg:R-EU_: RESISTOR, European symbol
R7 R51-R73 R75-R105 R107-R114 = Vwvwbg:R-EU_: RESISTOR, European symbol; SPICEPREFIX: R
R74 R106 = rcl_mod:R-TRIMM: Trimm resistor; SPICEMODEL: X; SPICEPREFIX: Z; SPICEPREFIXL: POT
S1 = Vwvwbg:VWV
SJ1 = jumper:SJ: SMD solder JUMPER
U$5 = Vwvwbg:TPS7A39
X1 = Vwvwbg:KK-156-3: KK 156 HEADER Source: http://www.molex.com/pdm_docs/sd/026604100_sd.pdf; MF: MOLEX; OC_FARNELL: unknown; OC_NEWARK: unknown

## Board
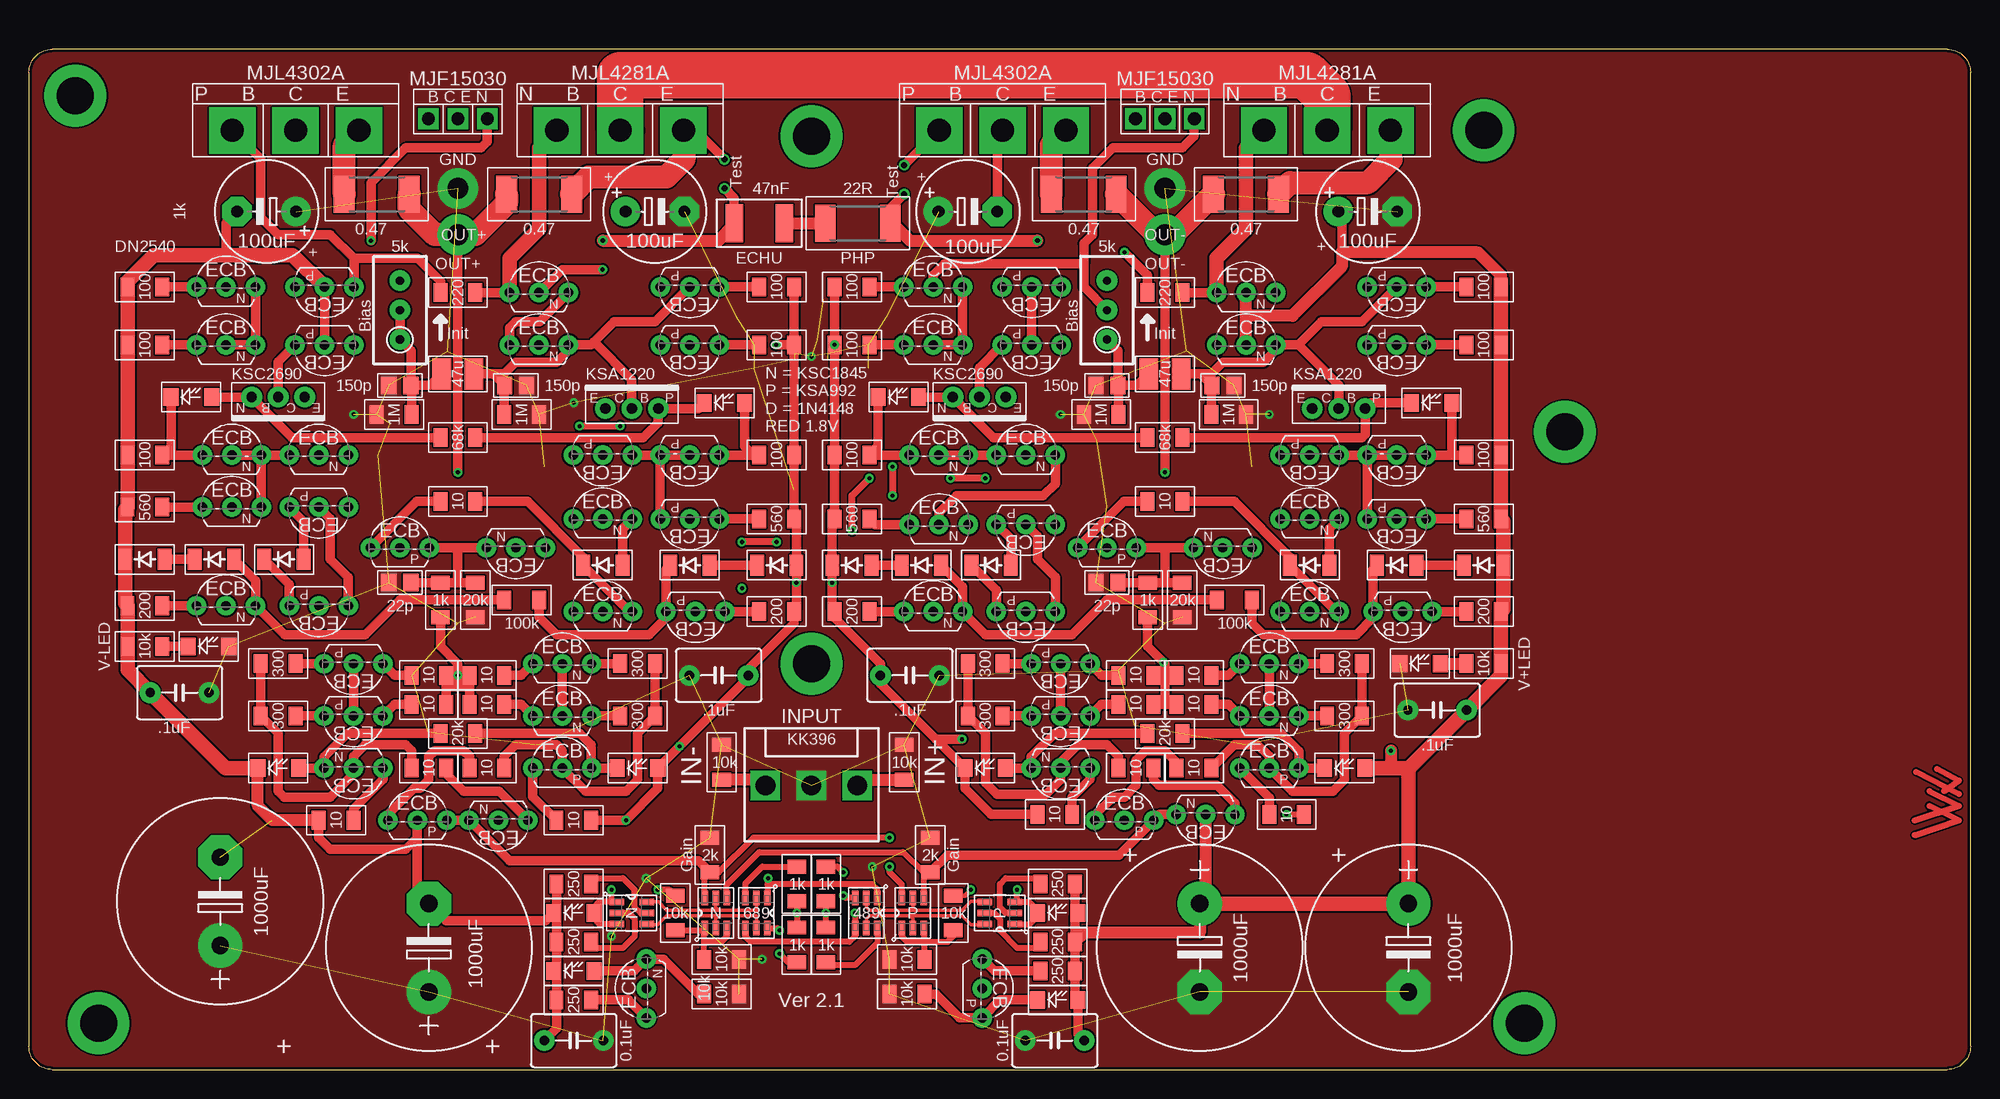
[diagram p3: board, top side]
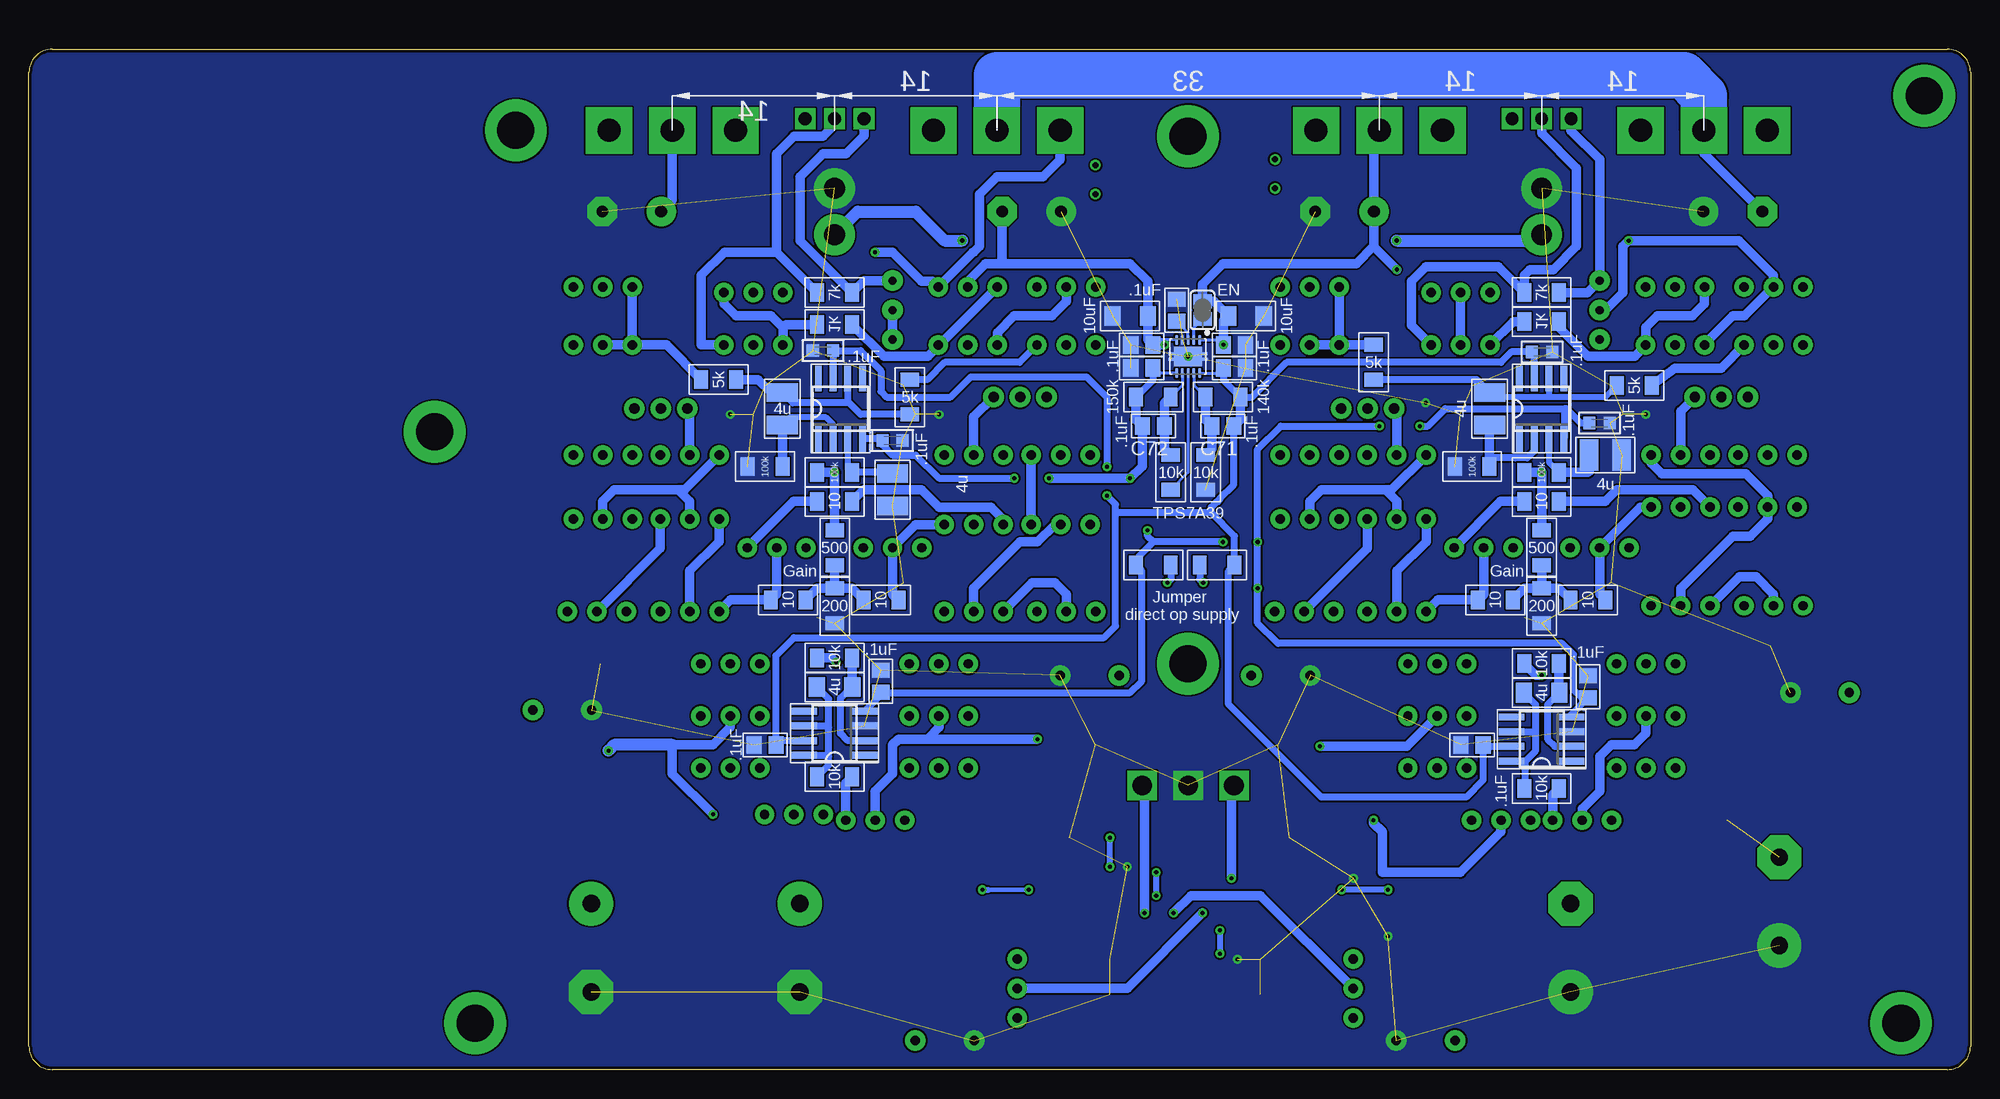
[diagram p4: board, bottom side, seen from below]

Size 167.5 x 88 mm. Coordinates in mm from the lower left corner, seen from the top.
Outline: 2,0 165.5,0 arc90 167.5,2 167.5,86 arc90 165.5,88 2,88 arc90 0,86 0,2 arc90 2,0
Copper layers (1*16): Top 0.035mm / dielectric 1.5mm / Bottom 0.035mm
Design rules "default *": minimum track width 6mil, minimum drill 0.35mm, track to track 6mil, track to pad 6mil, pad to pad 6mil, via to via 6mil, smd to smd 0mil, copper to edge 10mil, drill to drill 6mil, minimum pad ring 10mil, minimum via ring 8mil, stop-mask expansion 4mil, vias tented up to drill 0.35mm, thermal gap 3mil

### Footprints (pad centres in the part's own frame; a part is rotated, then mirrored left to right if it is on the bottom)
ECHU-Y = smd 1.5 x 3.3: 1 -2.15,0; 2 2.15,0
C0805 = smd 1.3 x 1.5: 1 -0.95,0; 2 0.95,0
E7,5-18 = drill 1.5 pad 3.81: + -3.81,0 | drill 1.5 pad 3.81 octagon: - 3.81,0
C050-045X075 = drill 0.813 pad 1.778: 1 -2.54,0; 2 2.54,0
C1206 = smd 1.4 x 1.7: 1 -1.527,0; 2 1.527,0
C1210 = smd 1.6 x 2.7: 1 -1.4,0; 2 1.4,0
C0603K = smd 1.05 x 1.08: 1 -0.875,0; 2 0.875,0
E5-8,5 = drill 1.016 pad 2.54: + -2.54,0 | drill 1.016 pad 2.54 octagon: - 2.54,0
SOD80C = smd 1.2 x 1.8: A 1.7,0; C -1.7,0
M3_HOLE = drill 3.2 pad 5.334: P$1 0,0
SOIC8 = smd 0.6 x 2.2: 1 -1.905,-2.6; 2 -0.635,-2.6; 3 0.635,-2.6; 4 1.905,-2.6; 5 1.905,2.6; 6 0.635,2.6; 7 -0.635,2.6; 8 -1.905,2.6
LED_SML1206 = smd 1.3 x 1.5: A 1.75,0; C -1.75,0
PAD-16 = drill 1.8 pad 3.5: P$1 0,0
SOT-23-6 = smd 1.27 x 0.559: 1 -1.295,0.95; 2 -1.295,0; 3 -1.295,-0.95; 4 1.295,-0.95; 5 1.295,0; 6 1.295,0.95
TRANSISTOR_TO92-ECB_P = drill 0.813 pad 1.676: B 2.54,0; C 0,0; E -2.54,0
TRANSISTOR_TO92-ECB_N = drill 0.813 pad 1.676: B 2.54,0; C 0,0; E -2.54,0
TRANSISTOR_TO126_P = drill 0.9 pad 1.778: B 2.286,0; C 0,0; E -2.286,0
TRANSISTOR_TO126_N = drill 0.9 pad 1.778: B 2.286,0; C 0,0; E -2.286,0
TRANSISTOR_TO220_BCE_N = drill 1.1 pad 1.778 square: B -2.54,0; C 0,0; E 2.54,0
TRANSISTOR_TO247_BCE_N = drill 2 pad 4 square: B -5.461,0; C 0,0; E 5.461,0
TRANSISTOR_TO247_BCE_P = drill 2 pad 4 square: B -5.461,0; C 0,0; E 5.461,0
MINI_MELF-0204W = smd 1.2 x 1.6: 1 -1.5,0; 2 1.5,0
RTRIM3296W = drill 0.7 pad 1.778: 1 0,-2.54; 2 0,0; 3 0,2.54
R2512 = smd 1.8 x 3.2: 1 -2.8,0; 2 2.8,0
SJ = smd 1.168 x 1.6: 1 -0.762,0; 2 0.762,0
SON50P300X300X80-11T165X240N = smd 0.86 x 0.27: 1 -1.435,1; 2 -1.435,0.5; 3 -1.435,0; 4 -1.435,-0.5; 5 -1.435,-1; 6 1.435,-1; 7 1.435,-0.5; 8 1.435,0; 9 1.435,0.5; 10 1.435,1 | smd 1.65 x 2.4: 11 0,0 | smd 0.25 x 0.5: 12 0.25,1.45; 13 -0.25,1.435; 14 -0.25,-1.45; 15 0.25,-1.45
KK-156-3 = drill 1.7 pad 2.54 square: 1 -3.96,0; 2 0,0; 3 3.96,0

### Placement (x,y rotation side)
C1  63,73 0 top
C2  68.5,65.5 90 bottom
C3  43,28 0 bottom
C4  33,33 90 bottom
C5  101,10.5 270 top
C6  16.5,14.5 90 top
C7  119,10.5 270 top
C8  34.5,10.5 90 top
C9  59.5,34 180 top
C10  76,34 180 top
C11  121.5,31 180 top
C12  13,32.5 180 top
C13  37,32.5 0 bottom
C14  104,28 0 bottom
C15  94,33.5 90 bottom
C16  98,33 0 bottom
C17  32,42 180 top
C18  37,60 180 top
C19  42,59 180 top
C20  32,59 180 top
C21  41.5,57 270 bottom
C22  31.5,53 180 bottom
C23  36.96,61.89 0 bottom
C24  32,55.75 180 bottom
C25  54,74 0 top
C26  20.5,74 180 top
C27  93,42 180 top
C28  98,60 180 top
C29  103,59 180 top
C30  93,59 180 top
C31  102.5,57 270 bottom
C32  93,50 90 bottom
C33  99,62 180 bottom
C34  93,54.25 180 bottom
C35  115.5,74 0 top
C36  81,74 0 top
C65  72.5,65 180 bottom
C66  62.5,65 0 bottom
C67  71.5,62.5 180 bottom
C68  63.5,62.5 0 bottom
C69  63.5,60.5 0 bottom
C70  71.5,60.5 0 bottom
C71  64.5,55.5 180 bottom
C72  70.5,55.5 180 bottom
C74  88.5,2.5 180 top
C75  47,2.5 180 top
D1  64.5,43.5 0 top
D2  57,43.5 0 top
D3  16,44 0 top
D4  10,44 0 top
D5  49.5,43.5 0 top
D6  22,44 0 top
D7  125.5,43.5 0 top
D8  118,43.5 0 top
D9  77,43.5 0 top
D10  71,43.5 0 top
D11  110.5,43.5 0 top
D12  83,43.5 0 top
H1  6,4 0 top
H2  129,4 0 top
H3  -12,86.5 0 top  (outside the outline)
H4  125.5,81 0 top
H5  4,84 0 top
H6  67.5,35 0 top
H7  132.5,55 0 top
H8  67.5,80.5 0 top
IC1  37,28.5 90 bottom
IC2  98,29 90 bottom
IC3  37,57 0 bottom
IC4  97.5,57 0 bottom
LED1  88.75,6 0 top
LED2  47,8.5 0 top
LED3  88.75,13.5 0 top
LED4  47,13.5 0 top
LED5  52.5,26 0 top
LED6  21.5,26 0 top
LED7  113.5,26 0 top
LED8  82.5,26 0 top
LED9  60,57.5 0 top
LED10  14,58 0 top
LED11  121,57.5 0 top
LED12  75,58 0 top
LED17  120,35 0 top
LED18  15.5,36.5 0 top
PAD1  37,72 0 top
PAD2  98,72 0 top
PAD3  98,76 0 top
PAD4  37,76 0 top
Q1  62.75,13.5 270 top
Q2  82.25,7 270 top
Q3  53.25,7 90 top
Q4  72.25,13.5 270 top
Q5  76.25,13.5 90 top
Q6  59.25,13.5 90 top
Q7  52,13.5 0 top
Q8  83.75,13.5 180 top
Q9  40.5,21.5 180 top
Q10  33.5,21.5 0 top
Q11  46,26 0 top
Q12  28,26 180 top
Q13  46,35 0 top
Q14  28,35 180 top
Q15  46,30.5 0 top
Q16  28,30.5 180 top
Q17  101.5,22 180 top
Q18  94.5,21.5 0 top
Q19  107,26 0 top
Q20  89,26 180 top
Q21  107,35 0 top
Q22  89,35 180 top
Q23  107,30.5 0 top
Q24  89,30.5 180 top
Q25  57.5,39.5 180 top
Q26  32,45 0 top
Q27  42,45 180 top
Q28  17,40 0 top
Q29  49.5,47.5 0 top
Q30  49.5,39.5 0 top
Q31  25,48.5 180 top
Q32  25,40 180 top
Q33  57,47.5 180 top
Q34  17.5,48.5 0 top
Q35  57,53 180 top
Q36  49.5,53 180 top
Q37  25,53 0 top
Q38  17.5,53 0 top
Q39  52,57 0 top
Q40  21.5,58 180 top
Q41  57,62.5 180 top
Q42  17,62.5 0 top
Q43  57,67.5 180 top
Q44  17,67.5 0 top
Q45  37,82 0 top
Q46  44,62.5 0 top
Q47  25.5,62.5 180 top
Q48  44,67 0 top
Q49  25.5,67.5 180 top
Q50  51,81 0 top
Q51  23,81 0 top
Q52  118.5,39.5 180 top
Q53  93,45 0 top
Q54  103,45 180 top
Q55  78,39.5 0 top
Q56  110.5,47.5 0 top
Q57  110.5,39.5 0 top
Q58  86,47 180 top
Q59  86,39.5 180 top
Q60  118,47.5 180 top
Q61  78.5,47 0 top
Q62  118,53 180 top
Q63  110.5,53 180 top
Q64  86,53 0 top
Q65  78.5,53 0 top
Q66  113,57 0 top
Q67  82,58 180 top
Q68  118,62.5 180 top
Q69  78,62.5 0 top
Q70  118,67.5 180 top
Q71  78,67.5 0 top
Q72  98,82 0 top
Q73  105,62.5 0 top
Q74  86.5,62.5 180 top
Q75  105,67 0 top
Q76  86.5,67.5 180 top
Q77  112,81 0 top
Q78  84,81 0 top
R3  75.75,6.5 0 top
R4  59.75,6.5 0 top
R5  88.75,8.5 0 top
R6  66.25,16 270 top
R7  47,6 0 top
R8  66.25,10.75 90 top
R9  68.75,16 90 top
R10  68.75,10.75 270 top
R11  58.75,18.5 270 top
R12  88.75,16 0 top
R13  47,16 0 top
R14  79.75,13.5 90 top
R15  75.75,9.5 0 top
R16  59.75,9.5 0 top
R17  55.75,13.5 270 top
R18  88.75,11 0 top
R19  47,11 0 top
R20  77.75,18.5 270 top
R21  37,24.25 0 bottom
R22  37,29 0 top
R23  47,21.5 0 top
R24  39.5,26 180 top
R25  34.5,26 180 top
R26  26.5,21.5 0 top
R27  52.5,35 0 top
R28  21.5,35 0 top
R29  37,35 0 bottom
R30  39.5,34 0 top
R31  34.5,34 0 top
R32  52.5,30.5 0 top
R33  21.5,30.5 0 top
R34  39.5,31.5 0 top
R35  34.5,31.5 0 top
R36  98,25.25 0 bottom
R37  98,29 0 top
R38  108.5,22 0 top
R39  100.5,26 180 top
R40  95.5,26 180 top
R41  88.5,22 0 top
R42  113.5,35 0 top
R43  82.5,35 0 top
R44  98,35.5 0 bottom
R45  100.5,34 0 top
R46  95.5,34 0 top
R47  113.5,30.5 0 top
R48  82.5,30.5 0 top
R49  100.5,31.5 0 top
R50  95.5,31.5 0 top
R51  35.5,40.5 270 top
R52  38.5,40.5 90 top
R53  42.5,40.5 0 top
R54  64.5,39.5 0 top
R55  37,49 0 top
R56  37,49 180 bottom
R57  10,40 0 top
R58  64.5,47.5 0 top
R59  41,40.5 180 bottom
R60  33,40.5 180 bottom
R61  10,48.5 0 top
R62  64.5,53 0 top
R63  37,40 90 bottom
R64  10,53 0 top
R65  37,54.5 0 top
R66  37,45 90 bottom
R67  64.5,62.5 0 top
R68  51.5,61 90 bottom
R69  29,59 180 bottom
R70  10,62.5 0 top
R71  64.5,67.5 0 top
R72  10,67.5 0 top
R73  37,67 180 bottom
R74  32,65.5 0 top
R75  42.5,56.5 0 top
R76  31.5,56.5 0 top
R77  37,64.5 180 bottom
R78  37,67 0 top
R79  43,52 0 bottom
R80  44,75.5 0 top
R81  30,75.5 0 top
R82  37,51.5 0 bottom
R83  96.5,40.5 270 top
R84  99.5,40.5 90 top
R85  104,40.5 0 top
R86  125.5,39.5 0 top
R87  98,49 0 top
R88  98,49 180 bottom
R89  71,39.5 0 top
R90  125.5,47.5 0 top
R91  102,40.5 180 bottom
R92  94,40.5 180 bottom
R93  71,47.5 0 top
R94  125.5,53 0 top
R95  98,40 90 bottom
R96  71,53 0 top
R97  98,54.5 0 top
R98  98,45 90 bottom
R99  125.5,62.5 0 top
R100  108,59.5 180 bottom
R101  91.5,58 270 bottom
R102  71,62.5 0 top
R103  125.5,67.5 0 top
R104  71,67.5 0 top
R105  98,67 180 bottom
R106  93,65.5 0 top
R107  103.5,56.5 0 top
R108  92.5,56.5 0 top
R109  98,64.25 180 bottom
R110  98,67 0 top
R111  104,52 0 bottom
R112  105,75.5 0 top
R113  91,75.5 0 top
R114  98,51.5 0 bottom
R131  125.5,35 0 top
R132  10,36.5 0 top
R133  71.5,73 0 top
R134  75.5,26.5 270 top
R135  59.75,26.5 270 top
R136  64.5,58 0 bottom
R137  66,51.5 90 bottom
R138  69,51.5 270 bottom
R139  70.5,58 0 bottom
R140  70.5,43.5 0 bottom
R141  65,43.5 180 bottom
S1  166.5,22.75 90 top
SJ1  66.25,65.5 90 bottom
U$5  67.5,61.5 270 bottom
X1  67.5,24.5 0 top

### Tracks (layer width: path | path; a pad name or v marks a point on that pad's centre or on a via)
+18V  (via drill 0.35)
  Top 0.61: v74.5,52 v74.5,49.5
  Bottom 0.254: U$5.10 64.89,60.06 C69.1
  Bottom 0.61: IC4.7 C33.1 95.75,62 94,60.25 94,58.5 93.5,58 88,58 86.25,59.75 76.25,59.75 74.5,58 v74.5,52 | IC1.7 41.92,27.86 C3.2 42.05,24.95 43.5,23.5 56,23.5 64,31.5 64,43 R141.1 63.5,46 65.5,48 | C69.1 64.45,59.45 R136.2 62,58 59,61 40.5,61 39.61,61.89 C23.1 37.64,61.69 IC3.7 | v74.5,49.5 73.75,48.75 73.75,48 | IC2.7 102.69,28.36 C14.2 103.05,35.7 101.5,37.25 74.75,37.25 73.75,38.25 73.75,48 | 65.5,48 73.75,48 | 65.5,48 65.5,48.5 65.06,48.94 65.01,48.94 64.74,49.21 64.74,49.26 63.55,50.45 C71.1
  Bottom 0.813: C71.1 63,56.05 R136.2
-18V  (via drill 0.35)
  Top 0.61: v82.5,51 v79.5,51 | v71,46.5 71,49.5 v72.5,51 | v64.5,45.5 v61.5,45.5 | v51,55.5 v47.5,55.5
  Bottom 0.254: U$5.6 70.11,60.06 C70.2
  Bottom 0.61: IC4.4 94.03,54.4 C34.2 93.88,53.88 93,53 91,53 89,51 v82.5,51 | C24.2 33.62,55.75 34.88,57 35,57 | 35,57 45.32,57 46.82,55.5 v47.5,55.5 | IC1.4 34.4,30.65 C4.1 33.55,32.05 34.25,32.75 34.25,35.8 34.71,36.26 34.76,36.26 35.25,36.75 59.75,36.75 61.5,38.5 v61.5,41.5 v61.5,45.5 61.5,53.5 59.5,55.5 v51,55.5 | C70.2 70.55,59.45 R139.1 | IC3.4 35,54.49 35,57 | IC2.4 94,32.3 C15.1 93.95,32.5 72.5,32.5 71.5,33.5 71.5,43 71.75,43.25 | 71.75,43.25 R140.1 | 71.75,43.25 71.75,44.25 70.5,45.5 | v64.5,45.5 70.5,45.5 | 70.5,45.5 71,46 v71,46.5
  Bottom 0.813: R139.1 72,56.05 C72.2 71.45,52.05 v72.5,51 v79.5,51
BOUT+  (via drill 0.35)
  Top 0.813: R31.2 36,33 | 36,33 R35.2 | R30.1 38,33 | 38,33 R34.1 | 36,33 37,33 | 37,33 38,33 | R51.2 35.5,36.5 37,35 v37,34 37,33
  Bottom 0.813: R29.1 37.5,34 v37,34
BOUT-  (via drill 0.35)
  Top 0.813: R46.2 98,34 | 98,34 R45.1 | R50.2 98,31.5 | 98,31.5 R49.1 | 98,34 98,31.5 | R83.2 96.5,36.5 v97.88,35.12 98,35 98,34
  Bottom 0.813: R44.1 98.25,35.5 v97.88,35.12
GND  (via drill 0.35)  (76 unrouted)
  other vias: 107,56.5 89,56.5 28,56.5 63.25,9.5 67.5,61.5 47,57.5 72.75,17.5 53.25,16.5 50.25,11.5
  pour Bottom (isolate 0.125, rank 5, no thermals): -0.5,93.99 167.44,93.99 167.44,-0.04 -0.5,-0.04
  pour Top (isolate 0.125, rank 5, no thermals): -0.5,88.49 167.44,88.49 167.44,-0.04 -0.5,-0.04
IN+  (via drill 0.35)
  Top 0.508: Q1.4 61.8,11.45 62.25,11 70.75,11 71.3,11.55 Q4.4 71.3,13.45 v71.25,13.5
  Top 1.016: X1.3 71.96,25 R134.2
  Bottom 0.813: X1.3 71.46,24.17 71.25,23.96 v71.25,13.5
IN-  (via drill 0.35)
  Top 0.508: Q4.1 73.2,15.55 72.75,16 63.75,16 | Q1.1 63.7,15.95 63.75,16 | 63.75,16 v63.75,16.5
  Top 1.016: X1.1 63.04,25 R135.2
  Bottom 0.813: X1.1 63.54,23.75 63.75,23.54 v63.75,16.5
N$2
  Top 0.508: Q8.2 84.25,13.5 83.75,14 83.75,16 84.25,16.5 86.75,16.5 R12.1
N$3
  Top 0.813: R54.1 Q25.E
N$4
  Top 0.813: Q10.E 30.96,21.96 33.25,24.25 33.75,24.25 34.5,25 34.5,27 35,27.5 37.5,27.5 38,27 R24.2
N$5
  Top 0.813: R26.2 28,22.5 30.54,25.04 Q12.E
N$6
  Top 0.813: R23.1 43.46,23.54 Q11.E
N$7
  Top 0.813: LED5.C Q11.B 48.5,26.04 48.5,28 47.5,29 R22.2
N$8
  Top 0.813: R22.1 27.5,29 25.46,26.96 Q12.B LED6.A
N$9
  Top 0.813: R24.1 41,27 42,28 45.5,28 46,27.5 Q11.C 48,24 51.5,24 52.5,25 52.5,29 R32.2 R27.2
N$10
  Top 0.813: R25.2 33,27.5 32.5,28 29,28 28,27 Q12.C 28,25.5 26,23.5 22,23.5 21.5,24 21.5,29 R33.1 R28.1
N$11
  Top 0.813: Q9.E 40.54,24 37.5,24 36,25.5 R25.1
N$12
  Top 0.813: D5.A 51.2,46.66 Q29.B
  Bottom 0.813: Q25.C 52.04,44.96 Q29.B
N$13
  Top 0.813: R27.1 Q13.B
N$14
  Top 0.813: Q13.E 42.46,34 R30.2
N$15
  Top 0.813: R33.2 Q16.B
N$16
  Top 0.813: Q15.B R32.1
N$17
  Top 0.813: Q14.B R28.2
N$18
  Top 0.813: Q14.E 31.54,34 R31.1
N$19
  Bottom 0.61: IC1.2 35.86,27.86 36.5,28.5 36.5,31.47 C13.2 35.5,32.53
  Bottom 0.813: 35.5,32.53 R29.2
N$20
  Top 0.813: Q15.E 42.46,31.5 R34.2
N$21
  Top 0.813: Q16.E 31.54,31.5 R35.1
N$22
  Bottom 0.61: C13.1 37.5,31.47 37.5,29 | IC1.8 38.41,26.59 | 38.41,26.59 37.5,27.5 37.5,29 | IC1.6 37.64,29.14 37.5,29 | R21.1 38.41,24.34 38.41,26.59
N$23
  Top 0.508: Q8.5 83.25,13.5 83.75,13 83.75,12 85.25,10.5 87.25,10.5 R18.1
N$24
  Bottom 0.254: SJ1.1 67,63.99 U$5.2
N$25
  Top 0.813: D1.C D2.A
N$26
  Top 0.813: D2.C 54.96,43.16 Q25.B 54.96,38.96 53.5,37.5 45.5,37.5 44,39 R53.2
N$27
  Top 0.813: R55.2 43,49 47.8,44.2 D5.C 51.8,39.5 Q30.B
N$28
  Bottom 0.813: Q29.E 46.96,45.54 49.5,43 Q30.C
N$29
  Bottom 0.813: Q27.C 42,41 R59.2 45.96,40.5 Q30.E
N$30
  Bottom 0.813: R60.2 35.5,41.5 R63.2 | R59.1 38.5,41.5 R63.2 | R63.2 R66.1
N$31
  Bottom 0.813: R60.1 32,41 Q26.C 28.5,48.5 Q31.E
N$32
  Top 0.813: D6.A 23.7,47.26 Q31.B
  Bottom 0.813: R56.1 31.5,49 30.5,50 23.96,50 Q31.B
N$33
  Top 0.813: D6.C 22.46,41.84 Q32.B
  Bottom 0.813: Q28.C 17,41 18.5,42.5 19.96,42.5 Q32.B
N$34
  Top 0.813: R57.2 Q28.E
N$35
  Top 0.813: D3.C D4.A
N$36
  Top 0.813: Q31.C 26,47.5 26,44 27.54,42.46 Q32.E
N$37
  Top 0.813: Q26.E 33.46,49 R55.1
N$38
  Bottom 0.813: R56.2 40.54,49 Q27.E
N$39
  Top 0.813: 37,42 R51.1 C17.1 | 37,42 R52.2 | Q27.B 37,45 | 37,45 Q26.B | 37,45 37,42
N$40
  Bottom 0.813: Q33.C 57,49 56,50 50.5,50 | 50.5,50 49.5,49 Q29.C | Q36.B 49.96,50 50.5,50
N$41
  Top 0.813: Q33.B Q35.B | Q35.C Q35.B | Q36.E Q35.B
N$42
  Top 0.813: R58.1 Q33.E
N$43
  Top 0.813: Q20.E 91.54,25.04 90,23.5 R41.2
N$44
  Top 0.813: Q19.E 107,23.46 R38.1
N$45
  Top 0.813: R37.2 108,29 109.54,27.46 Q19.B LED7.C
N$46
  Top 0.813: LED8.A Q20.B 86.46,26.96 88.5,29 R37.1
N$47
  Top 0.813: R39.1 104,28 106,28 107,27 Q19.C 109,24 112.5,24 113.5,25 113.5,29 R47.2 R42.2
N$48
  Top 0.813: R43.1 R48.1 82.5,29 82.5,24.75 83.5,23.75 87.75,23.75 89,25 Q20.C 89,26.5 90.5,28 93,28 94,27 R40.2
N$49
  Top 0.813: R39.2 99,26.5 98,27.5 96.31,27.5 95.5,26.69 95.5,24.5 94.5,23.5 93.5,23.5 91.96,21.96 Q18.E
N$50
  Top 0.813: Q17.E 104.04,22.96 102.5,24.5 97.5,24.5 97,25 R40.1
N$51
  Top 0.813: Q35.E 62.5,53 | 62.5,53 R62.1 | 62.5,53 61.75,53.75 LED9.A
N$52
  Top 0.813: R42.1 Q21.B
N$53
  Top 0.813: R43.2 Q22.B
N$54
  Top 0.813: R47.1 Q23.B
N$55
  Top 0.813: Q24.B R48.2
N$56
  Top 0.813: Q21.E 103.46,34 R45.2
N$57
  Top 0.813: Q22.E 92.54,34 R46.1
N$58
  Top 0.813: Q23.E 103.46,31.5 R49.2
N$59
  Top 0.813: Q24.E 92.54,31.5 R50.1
N$60
  Bottom 0.61: IC2.2 96.87,28.36 97.5,29 97.5,32.03 96.5,33.03
  Bottom 0.813: R44.2 96.5,33.03 C16.2
N$61
  Bottom 0.61: R36.1 98.5,26.25 98.5,27 | C16.1 98.5,31.97 98.5,29.5 | 98.5,27 98.5,29.5 | IC2.6 98.63,29.64 98.5,29.5 | IC2.8 98.59,27.09 98.5,27
N$62
  Bottom 0.813: Q36.C 49.5,56.79 Q39.E
N$63
  Top 0.813: LED9.C 57.75,57 Q39.B 54.29,55.79 53,54.5 R65.2
N$64
  Top 0.813: Q34.B Q38.B | Q38.C Q38.B | Q38.B Q37.E
N$65
  Top 0.813: R64.2 12,53 | 12,53 Q38.E | LED10.C 12.25,53.25 12,53
N$66
  Top 0.813: Q34.E R61.2
N$67
  Bottom 0.813: Q32.C 25,41.5 20.5,46 19,46 17.5,47.5 Q34.C 17.5,49.5 19.38,51.38 26.64,51.38 27.54,52.29 Q37.B
N$68
  Bottom 0.813: Q40.E 25,56.79 Q37.C
N$69
  Top 0.813: R65.1 22.71,54.5 Q40.B LED10.A
N$70
  Top 0.813: R75.1 41,58.95 C19.2 40.05,60 C18.1 41,60 42,61 45.5,61 46.54,62.04 Q46.B 48.5,62.5 48.75,62.75 | Q43.C 54,64.5 50.5,64.5 48.75,62.75 | Q39.C 52,59.5 48.75,62.75
  Bottom 0.813: Q45.C 37,80.75 34,77.75 34,71 36,69 38,69 38.5,68.5 R73.2 40.75,69.25 47,69.25 48.25,68 48.25,64.21 Q46.B
N$71
  Bottom 0.813: Q41.C Q41.B | Q41.B Q43.B | Q41.B R68.2
N$72
  Top 0.813: Q42.C Q42.B Q44.B
  Bottom 0.813: R69.1 25.5,60.5 21.5,60.5 19.54,62.46 Q42.B
N$73
  Top 0.813: R67.1 Q41.E
N$74
  Top 0.813: R71.1 Q43.E
N$76
  Top 0.813: R70.2 Q42.E
N$77
  Top 0.813: R72.2 Q44.E
N$78
  Top 0.813: Q48.B 44.04,64.5 42,64.5 41.46,63.96 Q46.E
  Bottom 0.813: R77.2 39.46,64.5 Q46.E
N$79
  Bottom 0.813: R77.1 35.5,64 33,61.5 28.96,61.5 27.96,62.5 Q47.E 28,62.54 28,64 27,65 24,65 22.96,66.04 Q49.B
N$80  (via drill 0.35)
  Top 0.813: R74.2 R74.1 32.95,62.01 C20.1 | C20.1 33,58.95 R76.2 | C18.2 34.6,59 C20.1 | Q40.C 21.5,61.04 Q47.B | Q45.E 39.54,80.04 39,79.5 32.5,79.5 29.5,76.5 v29.5,71.5
  Bottom 0.813: Q47.B 22.96,62.54 20.5,65 19.5,65 Q44.C 17,68.5 20,71.5 v29.5,71.5 30,71 30,67 31.5,65.5 R74.2
N$81
  Top 0.813: R78.2 Q48.E
  Top 1.27: Q50.B 44,79.46 44,72.5 41.46,69.96 Q48.E
N$82
  Top 0.813: R78.1 35.5,68 33.54,69.96 28.04,69.96 | Q49.E 28.04,69.96 | 28.04,69.96 26,72 21.5,72 20,73.5 20,78.54 Q51.B
N$83  (via drill 0.5)
  Top 0.813: Q50.E 57.5,81 v60,78.5
  Top 2: R80.2 48.3,77 55,77 56.5,78.5 56.5,80.96 Q50.E
N$84
  Top 2: R81.1 27.2,79.74 Q51.E
N$85
  Bottom 0.61: IC3.2 37.64,53.37 38.24,52.76 39.29,52.76 39.3,52.75 41.5,52.75
  Bottom 0.813: R79.2 41.5,52.75 C21.2
N$86
  Bottom 0.508: IC3.3 36.36,52.37 R82.2
  Bottom 0.813: R82.2 33,51.5 32.9,51.6 C22.2
N$87
  Top 0.813: D3.A 19.54,42.16 Q28.B 22.04,37.5 29,37.5 32,40.5 R53.1
N$88
  Bottom 0.813: R73.1 33.04,67 R74.3 32,78.5 34.46,80.96 Q45.B
N$89
  Bottom 0.508: C21.1 41.1,58 36.36,58 | IC3.6 36.36,58 | R69.2 31.5,58 36.36,58
  Bottom 0.61: C21.1 42.6,59.5 R68.1
N$93
  Top 0.508: Q7.5 52.75,13.5 52.25,14 52.25,15.5 51.25,16.5 48.5,16.5 R13.2
N$94
  Top 0.508: Q7.2 51.75,13.5 52.25,13 52.25,11.5 51.25,10.5 48.5,10.5 R19.2
N$95
  Top 0.305: Q1.5 62.75,13.25 59.5,13.25 | 59.5,13.25 59.25,13 Q6.2 | 59.5,13.25 55,13.25 54.25,12.5 53.34,12.5 Q7.4
N$96
  Top 0.305: Q6.5 59.25,14 59.5,13.75 | 59.5,13.75 62.75,13.75 Q1.2 | Q7.6 54.3,14.45 55,13.75 59.5,13.75
N$97  (via drill 0.35)
  Top 0.508: Q7.3 49.2,12.55 48.75,13 LED4.A 48.75,14 49.2,14.45 50.25,14.45 | Q7.1 50.25,14.45 | R17.1 55.25,15.5 v54.25,15.5 | 50.25,14.45 v50.25,15.5
  Bottom 0.508: v50.25,15.5 v54.25,15.5
N$98
  Top 0.508: R16.1 58.25,11 | 58.25,11 58.25,12.15 | 58.25,12.15 Q6.1 | Q6.3 60.2,11.45 59.75,11 58.25,11 | R17.2 58.09,12 58.25,12.15
N$99
  Top 0.813: LED2.A 52.21,8.5 Q3.B 53.29,9.5 54.75,9.5 57.75,6.5 R4.1
N$101
  Top 0.508: Q5.1 75.3,11.45 75.75,11 77.25,11 | 77.25,11 79.25,11 79.75,11.5 R14.1 | Q5.3 77.2,11.05 77.25,11 | R15.2 77.25,11
N$102
  Top 0.305: Q4.2 72.25,14 72.5,13.75 76,13.75 | 76,13.75 76.25,14 Q5.5 | 76,13.75 80.5,13.75 81.25,14.5 82.41,14.5 Q8.4
N$103  (via drill 0.35)
  Top 0.406: v81.25,15.5 80.75,15 R14.2
  Top 0.508: Q8.1 86.3,12.55 87,13.25 LED3.C 87,13.75 86.3,14.45 Q8.3 85.25,14.65 v85.25,15.5
  Bottom 0.406: 84.75,15.5 v81.25,15.5
  Bottom 0.508: v85.25,15.5 84.75,15.5
N$104
  Top 0.305: Q4.5 72.25,13 72.5,13.25 76,13.25 | 76,13.25 76.25,13 Q5.2 | 76,13.25 80.5,13.25 81.25,12.5 82.41,12.5 Q8.6
N$108
  Top 0.813: LED1.C 83.79,6 Q2.B 80.29,4.46 78.25,6.5 R3.2
N$109
  Top 0.813: Q2.E 83.29,8.5 R5.1
N$110  (via drill 0.35)
  Top 0.508: R6.2 v66.25,13.5 R8.2
  Bottom 0.813: Q2.C 72.75,7 v66.25,13.5
N$111  (via drill 0.35)
  Top 0.305: 65.5,9.25 R8.1
  Top 0.508: Q1.6 64.55,12.21 v64.75,12 | v64.75,10 65.5,9.25
  Bottom 0.508: v64.75,12 v64.75,10
N$112
  Top 0.508: Q1.3 61.8,16.05 63.25,17.5 R6.1
N$115  (via drill 0.35)
  Top 0.508: Q4.3 70.45,14.79 v70.25,15 | v70.25,17 69.75,17.5 R9.2
  Bottom 0.508: v70.25,15 v70.25,17
N$116
  Top 0.305: 69,9 R10.2
  Top 0.508: Q4.6 73.2,10.95 71.25,9 69,9
N$117  (via drill 0.35)
  Top 0.508: R10.1 v68.75,13.5 R9.1
  Bottom 0.813: Q3.C 61.25,15 67.25,15 v68.75,13.5
N$118
  Top 0.813: Q3.E 51.75,5.96 51.75,6 R7.2
N$138
  Top 0.813: R132.2 LED18.C
N$139
  Top 1.016: LED17.A R131.1
N$140
  Top 1.016: C1.2 R133.1
N$142
  Bottom 0.254: U$5.7 68,59 R139.2
  Bottom 0.813: R138.1 69.55,53.55 C72.1 69.55,57.45 R139.2
N$145
  Bottom 0.254: R138.2 67.5,51.5 U$5.8
N$146
  Bottom 0.254: U$5.9 67,59 R136.1
  Bottom 0.813: R136.1 66,56.05 C71.2 65.45,53.55 R137.2
N$148
  Bottom 0.254: U$5.3 67.5,63.55 C2.1
N$159
  Top 0.813: R86.1 Q52.E
N$160
  Top 0.813: D11.A 112.2,46.66 Q56.B
  Bottom 0.813: Q52.C 113.04,44.96 Q56.B
N$161
  Top 0.813: D7.C D8.A
N$162
  Top 0.813: D8.C 115.96,43.16 Q52.B 115.96,38.96 114.5,37.5 106.5,37.5 105.5,38.5 R85.2
N$163
  Top 0.813: R87.2 104,49 108.8,44.2 D11.C 112.8,39.5 Q57.B
N$164
  Bottom 0.813: Q56.E 107.96,45.54 110.5,43 Q57.C
N$165
  Bottom 0.813: Q54.C 103,41 R91.2 106.96,40.5 Q57.E
N$166
  Bottom 0.813: R92.2 96.5,41.5 R95.2 | R91.1 99.5,41.5 R95.2 | R95.2 R98.1
N$167
  Bottom 0.813: R92.1 93,41 Q53.C 91,47 Q58.E
N$168
  Top 0.813: D12.A 84.7,45.76 Q58.B
  Bottom 0.813: R88.1 95.5,50 90.5,50 89,48.5 84.5,48.5 83.46,47.46 Q58.B
N$169
  Top 0.813: D12.C 83.46,41.34 Q59.B
  Bottom 0.813: Q55.C 78,41 79,42 80.96,42 Q59.B
N$170
  Top 0.813: Q55.E R89.2
N$171
  Top 0.813: D9.C D10.A
N$172
  Top 0.813: Q58.C 87,46 87,44 88.54,42.46 Q59.E
N$173
  Top 0.813: Q53.E 94.46,49 R87.1
N$174
  Bottom 0.813: R88.2 101.54,49 Q54.E
N$175
  Top 0.813: 98,42 R83.1 C27.1 | 98,42 R84.2 | Q54.B 98,45 | 98,45 Q53.B | 98,45 98,42
N$176
  Bottom 0.813: Q60.C 118,49 117,50 111.5,50 | 111.5,50 110.5,49 Q56.C | Q63.B 110.96,50 111.5,50
N$177
  Top 0.813: Q60.B Q62.B | Q62.C Q62.B | Q63.E Q62.B
N$178
  Top 0.813: R90.1 Q60.E
N$179
  Top 0.813: Q62.E 122.5,53 | 122.5,53 R94.1 | LED11.A 122.75,53.25 122.5,53
N$180
  Bottom 0.813: Q63.C 110.5,56.79 Q66.E
N$181
  Top 0.813: R97.2 115,54.5 115.29,54.79 Q66.B 115.79,57.5 LED11.C
N$182
  Top 0.813: Q65.C Q65.B Q64.E
  Bottom 0.813: Q65.B Q61.B
N$231
  Top 0.813: Q65.E R96.2 73.25,53.75 LED12.C
N$232
  Top 0.813: R93.2 73,47 Q61.E
N$233
  Top 0.813: Q64.B 88.54,50.54 87.5,49.5 80,49.5 78.5,48 Q61.C
  Bottom 0.813: Q59.C 86,41.5 82,45.5 80.5,45.5 79,47 Q61.C
N$234
  Bottom 0.813: Q67.E 86,56.29 Q64.C
N$235
  Top 0.813: R97.1 83.21,54.5 Q67.B LED12.A
N$236
  Top 0.813: R107.1 102,58.95 C29.2 101.05,60 C28.1 102,60 103,61 106.5,61 107.54,62.04 Q73.B 109.5,62.5 | Q70.C 115,64.5 111.5,64.5 109.5,62.5 | Q66.C 113,59 109.5,62.5
  Bottom 0.813: Q73.B 109.5,62.5 109.5,68.5 107.5,70.5 103,70.5 | 103,70.5 103,79 101.5,80.5 99,80.5 98,81.5 Q72.C | R105.2 103,70.5
N$237
  Bottom 0.813: R100.2 112.5,62.5 Q68.B | Q68.C Q68.B | Q68.B Q70.B
N$238
  Top 0.813: Q69.C Q69.B Q71.B
  Bottom 0.61: Q69.B 82.04,61 88.5,61 90,59.5 R101.1
N$239
  Top 0.813: R99.1 Q68.E
N$240
  Top 0.813: R103.1 Q70.E
N$242
  Top 0.813: R102.2 Q69.E
N$243
  Top 0.813: R104.2 Q71.E
N$244
  Bottom 0.813: Q73.E 102.46,63.96 | Q75.B 107.54,66.04 106.5,65 103.5,65 102.46,63.96 | 102.46,63.96 102.17,64.25 R109.2
N$245
  Bottom 0.813: Q76.B 88.96,62.5 | 88.96,62.5 Q74.E | R109.1 93.75,61.5 89.96,61.5 88.96,62.5
N$246
  Top 0.813: C30.1 94,58.95 R108.2 | C28.2 95.6,59 C30.1 | C30.1 93.95,62.01 R106.1 | Q67.C 82,60.54 Q74.B | Q72.E 100.5,81.96 100.5,80.5 99.5,79.5 93.5,79.5 91.75,77.75 91.75,72 91,71.25 91,69.5 | R106.2 91,67.5 91,69.5 | 91,69.5 79,69.5 78,68.5 Q71.C
  Bottom 0.813: Q71.C 78,66.25 79.25,65 82.5,65 83.96,63.54 Q74.B | R106.1 R106.2
N$247
  Top 0.813: R110.2 Q75.E
  Top 1.27: Q77.B 105,79.46 105,72.5 102.46,69.96 Q75.E
N$248  (via drill 0.35, 0.5)
  Top 0.813: R110.1 96.5,68.5 v94.5,70.5 | Q78.B 78.5,81 v75.5,78
  Bottom 0.813: v94.5,70.5 93,70.5 90.5,68 89.54,68 Q76.E 86.04,70.5 86,70.5 85.5,71 85.5,75.5 84,77 80,77 78.54,78.46 Q78.B
N$249
  Top 2: R112.2 108.8,76.5 115.5,76.5 117.5,78.5 117.5,80.96 Q77.E
N$250
  Top 2: R113.1 88.2,79.74 Q78.E
N$251
  Bottom 0.508: IC4.2 98.13,55.63 98.75,56.25 101.85,56.25 102.3,55.8
  Bottom 0.813: R111.2 C31.2 102.3,55.8
N$252
  Bottom 0.508: IC4.3 96.87,51.87 R114.2
  Bottom 0.61: C32.2 93.1,51.5 R114.2
N$253
  Top 0.813: D9.A 80.54,41.66 Q55.B 82.54,37.5 90,37.5 93,40.5 R85.1
N$254
  Bottom 0.813: Q72.B 95.46,80.54 97,79 99,79 101,77 101,71.5 R105.1 95.46,68.04 R106.3
N$255
  Bottom 0.508: C31.1 102.3,58.2
  Bottom 0.61: 102.3,58.2 101.6,57.5 96.75,57.5 | IC4.6 96.87,57.62 96.75,57.5 | R101.2 95.75,56.5 96.75,57.5
  Bottom 0.813: C31.1 103.5,58.4 104.6,59.5 R100.1
OUT+  (via drill 0.35, 0.4, 0.5)
  Top 0.813: PAD1.P$1 v37,51.5 | C1.1 60.85,75.15 v60,76
  Top 1.016: v49.5,71.5 59.5,71.5 60.85,72.85 C1.1
  Top 2: R80.1 41.2,74.7 38.5,72 PAD1.P$1 35,72 32.8,74.2 R81.2
  Bottom 0.813: R66.2 v37,51.5 R82.1
  Bottom 1.016: v49.5,71.5 37.5,71.5 PAD1.P$1
OUT-  (via drill 0.35, 0.4, 0.5)
  Top 0.813: v98,51.5 PAD2.P$1 | R133.2 74.3,74.3 v75.5,75.5
  Top 1.016: R133.2 74.5,73 76,71.5 v87,71.5
  Top 2: R112.1 98.7,72 PAD2.P$1 97.3,72 R113.2
  Bottom 0.813: R98.2 v98,51.5 R114.1
  Bottom 1.016: PAD2.P$1 96,74 91,74 88.5,71.5 v87,71.5
UOUT+  (via drill 0.35)
  Top 0.508: Q6.6 58.25,14.85 58.25,16.5 R11.2 59.5,17 62.5,20 v74.25,20 | Q5.6 75.3,15.95 74.25,17 v74.25,17.5
  Top 0.813: Q10.B Q9.B 41.46,18 57.75,18 R11.2
  Bottom 0.508: v74.25,17.5 v74.25,20
  Bottom 0.813: R21.2 36.04,23.71 Q10.B
UOUT-
  Top 0.508: Q5.4 77.2,16.95 | R20.2 77.45,16.7 77.2,16.95 | Q6.4 60.2,15.95 63,18.75 75.4,18.75 77.2,16.95
  Top 0.813: R20.2 79.25,18.5 94.04,18.5 Q18.B 97.54,22 Q17.B
  Bottom 0.813: R36.2 97.04,24.71 Q18.B
V+  (via drill 0.35)
  Top 0.508: 90.38,13.38 LED3.A | v108.5,22 R38.2
  Top 0.61: D1.A 66.2,44.5
  Top 0.813: Q15.C Q13.C | R71.2 R67.2 | R67.2 R62.2 R58.2 66.2,47.3 66.2,44.5 | D1.A v66.2,42 66.2,39.7 R54.2 66,38.5 62.04,34.54 C9.1 62.04,33.79 v56.12,27.88 LED5.A 54.25,24.25 v51.5,21.5 R23.2 | 90.25,13.25 R18.2 R5.2 90.25,6.25 LED1.A 90.5,3.04 C74.1 | 90.25,13.25 90.38,13.38 | R12.2 90.25,13.25 | Q21.C Q23.C | R67.2 C68.1 | C35.+ 113.25,73.71 113.25,70.5 | Q48.C 46,69 v49.5,69
  Top 1.016: v117.5,27.5 117.5,26 | Q17.C 101.5,14.81 C5.+ 101,11.81 91.06,11.81 R18.2 | R103.2 127,68.5 125.04,70.46 124.88,70.46 124.84,70.5 113.25,70.5 113.25,69.25 109,65 105,65 | Q73.C 105,65 | 105,65 Q75.C
  Top 1.27: R103.2 R99.2 R94.2 R90.2 127.2,47.3 D7.A 127.2,39.7 R86.2 R131.2 127,33.96 C11.1 119.04,26 | 119.04,26 117.5,26 LED7.A | 119.04,26 119,25.96 C7.+ C5.+
  Top 4: Q77.C 112,84 110.25,85.75 51,85.75 Q50.C
  Bottom 0.254: C68.1 64.89,62.94 U$5.1
  Bottom 0.61: R141.2 66.5,42.3 v66.2,42
  Bottom 0.813: v108.5,22 112,25.5 112,28 108.5,28 107,29.5 Q23.C | Q15.C 48.62,27.88 v56.12,27.88 | C68.1 64.45,64.58 C66.1 65.29,66.26 SJ1.2 66.25,67.75 64.5,69.5 53,69.5 51.46,71.04 | Q9.C 40.5,20.5 44,17 50.75,17 50.75,20.5 51.5,21.25 v51.5,21.5 | Q48.C Q46.C | C35.+ 112,74.96 Q77.C | Q50.C 51.46,80.54 C25.+ 51.46,71.04 | v49.5,69 51.46,70.96 51.46,71.04
  Bottom 1.016: 112,28 117,28 v117.5,27.5
  other vias: 64.45,62.5
V-  (via drill 0.35)  (1 unrouted)
  Top 0.813: Q16.C Q14.C | Q76.C Q74.C | 69.3,48 D10.C v69.3,42 69.3,39.7 R89.1 69.5,38.96 73.46,35 C10.2 73.46,33.29 78.25,28.5 | R104.1 R102.1 R96.1 69.5,48.2 69.3,48 | Q49.C Q47.C | 8.3,48.3 8.3,48 | 8.3,48 D4.C | R61.1 8.5,48.2 8.3,48 | R13.1 45.5,13.75 | 45.5,13.75 LED4.C 44.56,12.81 36,12.81 C8.- 33.5,15.31 Q10.C 33.5,20 32.5,19 26,19 25,20 R26.1 23.69,21.5 | 45.5,13.75 R19.1 45.5,8.75 LED2.C 45.5,8.25 R7.1 45.5,3.54 C75.2 | R41.1 83,22 80.75,24.25 LED8.C 78.25,28.5 | Q22.C Q24.C | 69.3,48 69.5,47.8 R93.1 | v80.5,28.5 78.25,28.5 | 17,70.25 17,73.04 C26.- | 83.5,73.96 C36.- 83.54,80.54 Q78.C
  Top 1.016: R26.1 21,21.5 19.75,22.75 LED6.C
  Top 1.27: LED6.C 16.96,26 C12.2 8.5,34.46 R132.1 R57.1 8.3,40.2 D4.C 8.3,48.3 R61.1 R64.1 R70.1 R72.1 8.5,68 10.75,70.25 17,70.25 22.75,70.25 Q49.C
  Bottom 0.254: U$5.5 70.11,62.94 C67.1
  Bottom 0.61: R140.2 69,42.3 v69.3,42
  Bottom 0.813: 90,28.5 92.5,28.5 93,28 93,25.5 94.5,24 Q18.C | 90,28.5 89,29.5 Q24.C | 90,28.5 v80.5,28.5 | Q16.C 28,29 29,28 31,28 32,27 32,24 33.5,22.5 Q10.C | R102.1 C67.1 70.97,62.92 C65.1 70.97,67.97 72.5,69.5 83.5,69.5 | Q76.C 86.5,68 85,69.5 83.5,69.5 | C36.- 83.54,69.54 83.5,69.5 | C26.- 23,79.04 Q51.C
  Bottom 4: Q51.C 23,84 24.75,85.75 84,85.75 Q78.C
  other vias: 69.5,62.5

### Text on the board
tPlace: MJL4302A | MJF15030 | MJL4281A | MJL4302A | MJF15030 | MJL4281A | GND | Test | GND | + | + | Test | 47nF | 22R | 1k | 100uF | 0.47 | OUT+ | 0.47 | 100uF | 0.47 | OUT- | 0.47 | 100uF | DN2540 | 5k | 100uF | 5k | + | + | OUT+ | ECHU | PHP | OUT- | 100 | 100 | 100 | 100 | 220 | 220 | Bias | Bias | Init | Init | 100 | 100 | 100 | 100 | KSC2690 | 47u | KSA1220 | KSC2690 | 47u | KSA1220 | 150p | 150p | 150p | 150p | 1M | 1M | 1M | 1M | N = KSC1845 / P = KSA992 / D = 1N4148 / RED 1.8V | 68k | 68k | 100 | 100 | 100 | 100 | 10 | 10 | 560 | 560 | 560 | 560 | 200 | 22p | 1k | 20k | 200 | 200 | 22p | 1k | 20k | 200 | 100k | 100k | V-LED | 10k | 300 | 300 | 300 | 300 | 10k | V+LED | 10 | 10 | 10 | 10 | 10 | 10 | 10 | 10 | .1uF | .1uF | .1uF | 300 | 300 | INPUT | 300 | 300 | 20k | 20k | KK396 | .1uF | 10 | 10 | 10k | 10k | 10 | 10 | IN- | IN+ | 10 | 10 | 10 | 10 | Gain | 2k | 2k | Gain | + | + | 250 | 1k | 1k | 250 | 1000uF | N | 10k | N | 689 | 489 | P | 10k | P | 250 | 1k | 1k | 250 | 1000uF | 10k | 10k | 1000uF | 1000uF | 250 | 10k | 250 | 10k | Ver 2.1 | 10k | + | + | 0.1uF | 0.1uF
bPlace: 7k | .1uF | 7k | 10uF | 10uF | 1k | 1k | .1uF | .1uF | .1uF | .1uF | 5k | 5k | 5k | 140k | 150k | 5k | 4u | 4u | .1uF | .1uF | .1uF | .1uF | 100k | 100k | 10k | 10k | 100k | 100k | 4u | 4u | 10 | 10 | TPS7A39 | 500 | 500 | Gain | Gain | 10 | 200 | 10 | Jumper / direct op supply | 10 | 200 | 10 | .1uF | .1uF | 10k | 10k | 4u | 4u | .1uF | 10k | 10k | .1uF
bNames: EN